# EAGLE schematic b0_comp (EAGLE 6.4), part 1 of 2

## Sheet 1 of 9
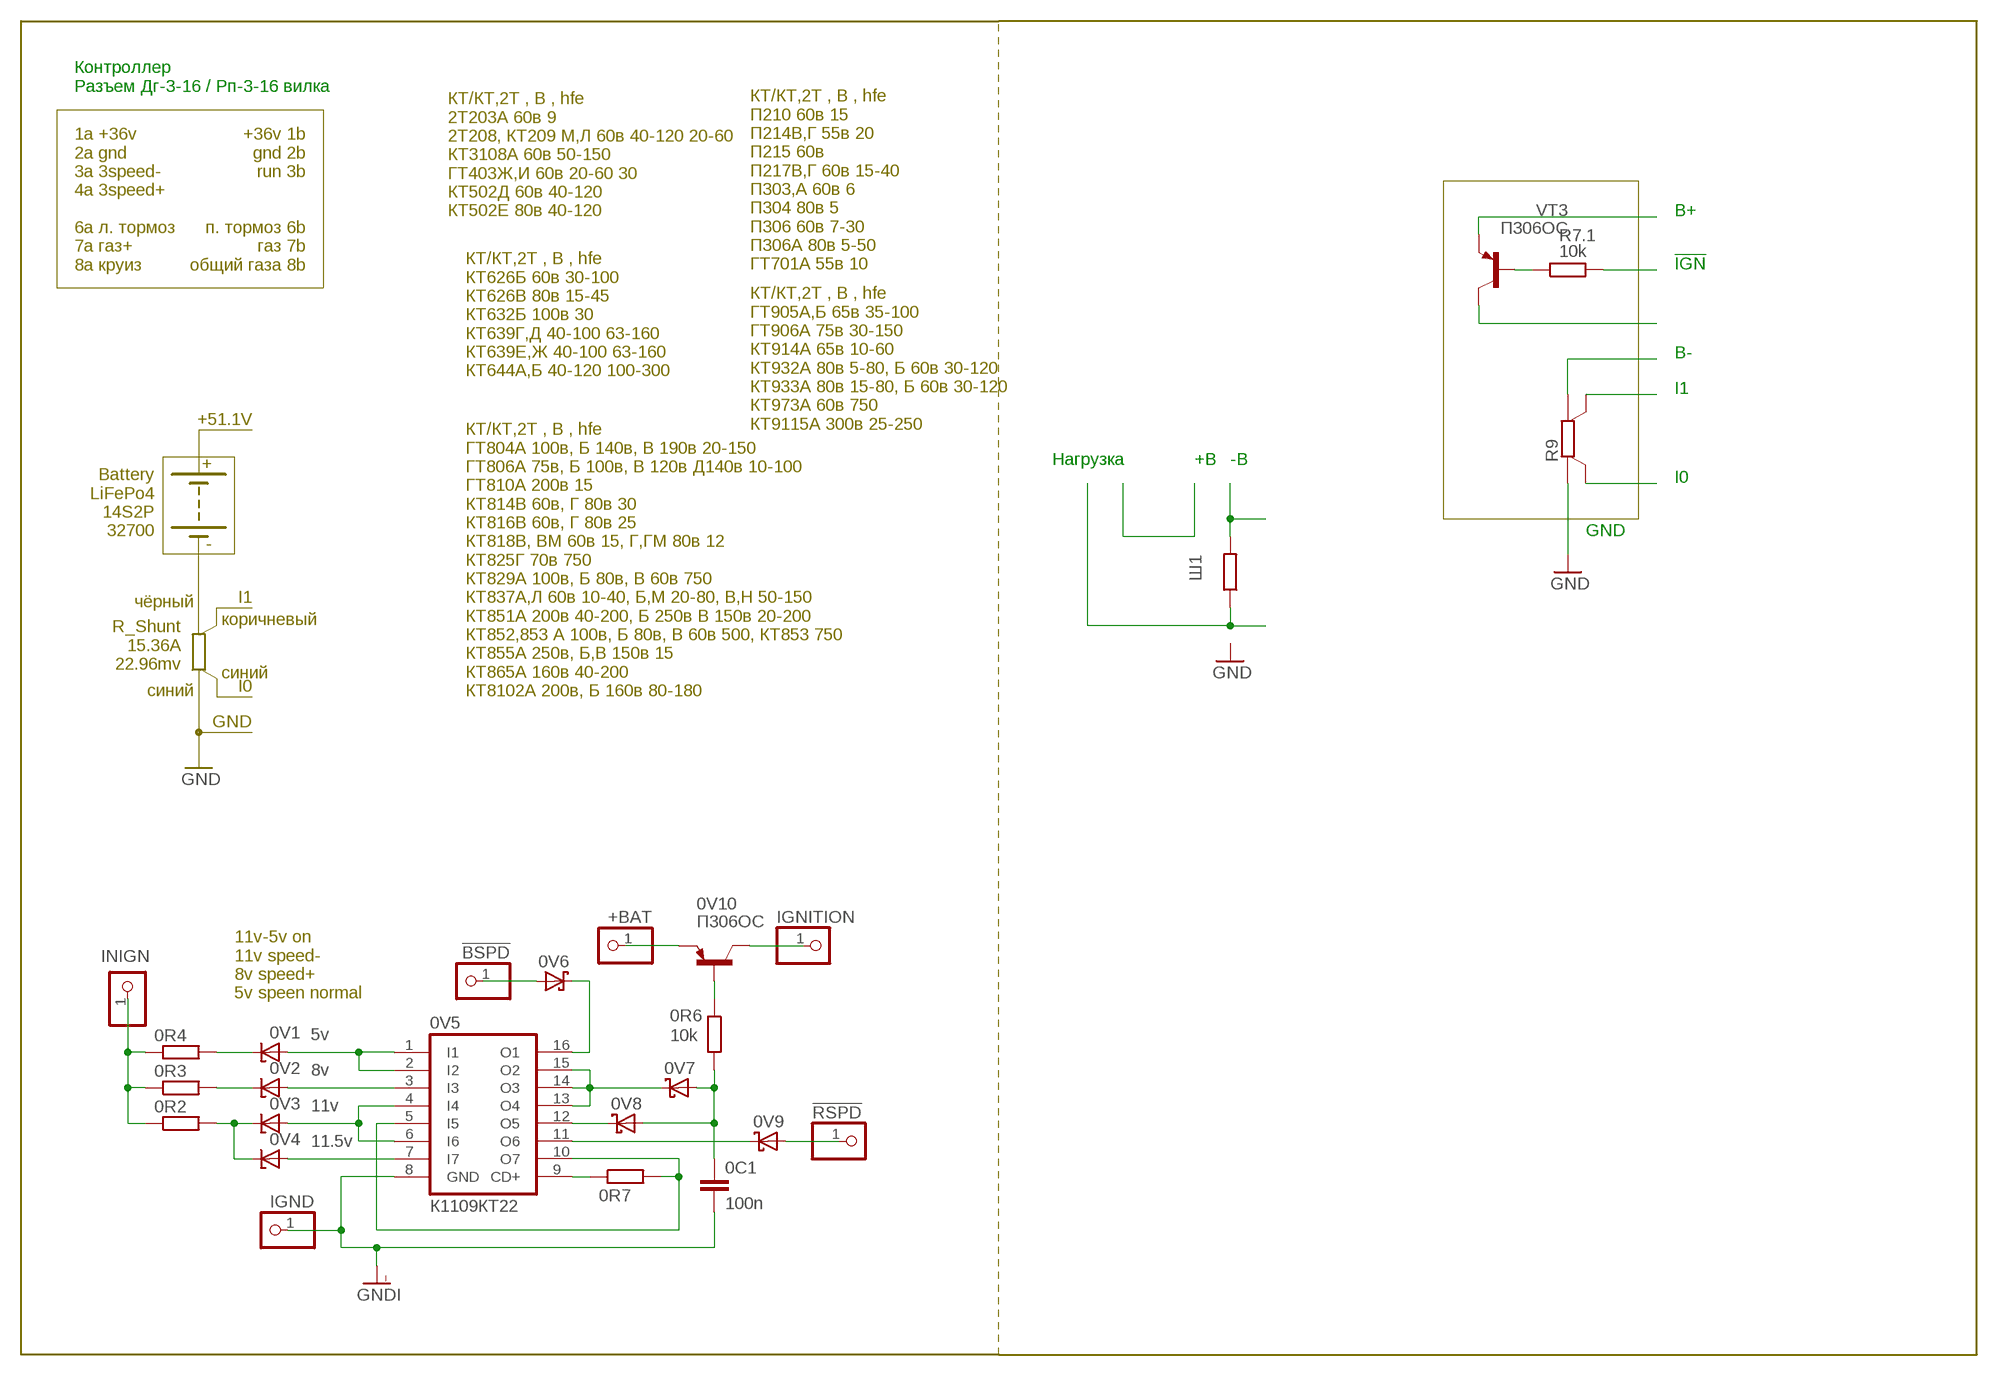
[diagram p0: schematic, sheet 1]

### Parts
0C1  100n  C-EUC0805  [C0805]
0R2  R-EU_R0805  [R0805]
0R3  R-EU_R0805  [R0805]
0R4  R-EU_R0805  [R0805]
0R6  10k  R-EU_R0805  [R0805]
0R7  R-EU_R0805  [R0805]
0V1  5v  ZENER-DIODEDO34-7  [DO34Z7]
0V2  8v  ZENER-DIODEDO34-7  [DO34Z7]
0V3  11v  ZENER-DIODEDO34-7  [DO34Z7]
0V4  11.5v  ZENER-DIODEDO34-7  [DO34Z7]
0V5  К1109КТ22  ULN2003AN  [DIL16]
0V6  SCHOTTKY-DIODESMD  [SMB]
0V7  SCHOTTKY-DIODESMD  [SMB]
0V8  SCHOTTKY-DIODESMD  [SMB]
0V9  SCHOTTKY-DIODESMD  [SMB]
0V10  П306ОС  BJT_PNP_TO-92_CBE  [TO92]
!BSPD  PINHD-1X1  [1X01]
!RSPD  PINHD-1X1  [1X01]
+BAT  PINHD-1X1  [1X01]
IGND  PINHD-1X1  [1X01]
IGNITION  PINHD-1X1  [1X01]
INIGN  PINHD-1X1  [1X01]
R7.1  10k  R-EU_R0805  [R0805]
R9  PMA-A  [PMA-A]
R_SHUNT  S  [S]
VT3  П306ОС  BJT_PNP_TO-92_EBC  [TO92]
Ш1  R-EU_R0805  [R0805]

### Nets
GND: R9.B ; also sheet 2,3,4,5,6,8,9
GNDI: 0C1.2 0V5.8(GND) IGND.1 ; also sheet 3
N$3: 0V5.13(O4) 0V5.14(O3) 0V5.15(O2) 0V7.C
N$64: VT3.3(C)
N$79: 0V3.A 0V5.4(I4) 0V5.6(I6)
N$80: 0C1.1 0R6.2 0V7.A 0V8.A
N$81: 0V2.A 0V5.3(I3)
N$82: 0R3.2 0V2.C
N$83: 0R2.1 0R3.1 0R4.1 INIGN.1
N$84: 0V1.A 0V5.1(I1) 0V5.2(I2)
N$85: 0R4.2 0V1.C
N$86: 0R6.1 0V10.2(B)
N$87: 0V10.1(C) IGNITION.1
N$88: 0V4.A 0V5.7(I7)
N$89: 0R2.2 0V3.C 0V4.C
N$90: 0V6.A !BSPD.1
N$91: 0R7.2 0V5.5(I5) 0V5.10(O7)
N$92: 0V5.11(O6) 0V9.C
N$93: 0V9.A !RSPD.1
N$94: 0V5.16(O1) 0V6.C
N$96: 0V10.3(E) +BAT.1
N$97: 0R7.1 0V5.9(CD+)
N$99: 0V5.12(O5) 0V8.C
N$100: Ш1.2
N$101: Ш1.1
N$104: R9.SB
N$105: R9.A
N$106: R9.SA
N$107: R7.1.1 VT3.2(B)
N$114: R7.1.2
N$115: VT3.1(E)

### Notes on the sheet
- Контроллер
  Разъем Дг-3-16 / Рп-3-16 вилка
- 1a +36v
  2a gnd
  3a 3speed-
  4a 3speed+
  
  6a л. тормоз
  7a газ+
  8a круиз
- +36v 1b
  gnd 2b
  run 3b
  
  
  п. тормоз 6b
  газ 7b
  общий газа 8b
- КТ/КТ,2Т , В , hfe
  2Т203А 60в 9
  2Т208, КТ209 М,Л 60в 40-120 20-60
  КТ3108А 60в 50-150
  ГТ403Ж,И 60в 20-60 30
  КТ502Д 60в 40-120
  КТ502Е 80в 40-120
- B+
- КТ/КТ,2Т , В , hfe
  П210 60в 15
  П214В,Г 55в 20
  П215 60в
  П217В,Г 60в 15-40
  П303,А 60в 6
  П304 80в 5
  П306 60в 7-30
  П306А 80в 5-50
  ГТ701А 55в 10
- !IGN
- B-
- КТ/КТ,2Т , В , hfe
  КТ626Б 60в 30-100
  КТ626В 80в 15-45
  КТ632Б 100в 30
  КТ639Г,Д 40-100 63-160
  КТ639Е,Ж 40-100 63-160
  КТ644А,Б 40-120 100-300
- I1
- КТ/КТ,2Т , В , hfe
  ГТ905А,Б 65в 35-100
  ГТ906А 75в 30-150
  КТ914А 65в 10-60
  КТ932А 80в 5-80, Б 60в 30-120
  КТ933А 80в 15-80, Б 60в 30-120
  КТ973А 60в 750
  КТ9115А 300в 25-250
- Нагрузка | +B | -B
- I0
- GND
- чёрный
- коричневый
- синий
- синий
- КТ/КТ,2Т , В , hfe
  ГТ804А 100в, Б 140в, В 190в 20-150
  ГТ806А 75в, Б 100в, В 120в Д140в 10-100
  ГТ810А 200в 15
  КТ814В 60в, Г 80в 30
  КТ816В 60в, Г 80в 25
  КТ818В, ВМ 60в 15, Г,ГМ 80в 12
  КТ825Г 70в 750
  КТ829А 100в, Б 80в, В 60в 750
  КТ837А,Л 60в 10-40, Б,М 20-80, В,Н 50-150
  КТ851А 200в 40-200, Б 250в В 150в 20-200
  КТ852,853 А 100в, Б 80в, В 60в 500, КТ853 750
  КТ855А 250в, Б,В 150в 15
  КТ865А 160в 40-200
  КТ8102А 200в, Б 160в 80-180
- 11v-5v on
  11v speed-
  8v speed+
  5v speen normal

## Sheet 2 of 9
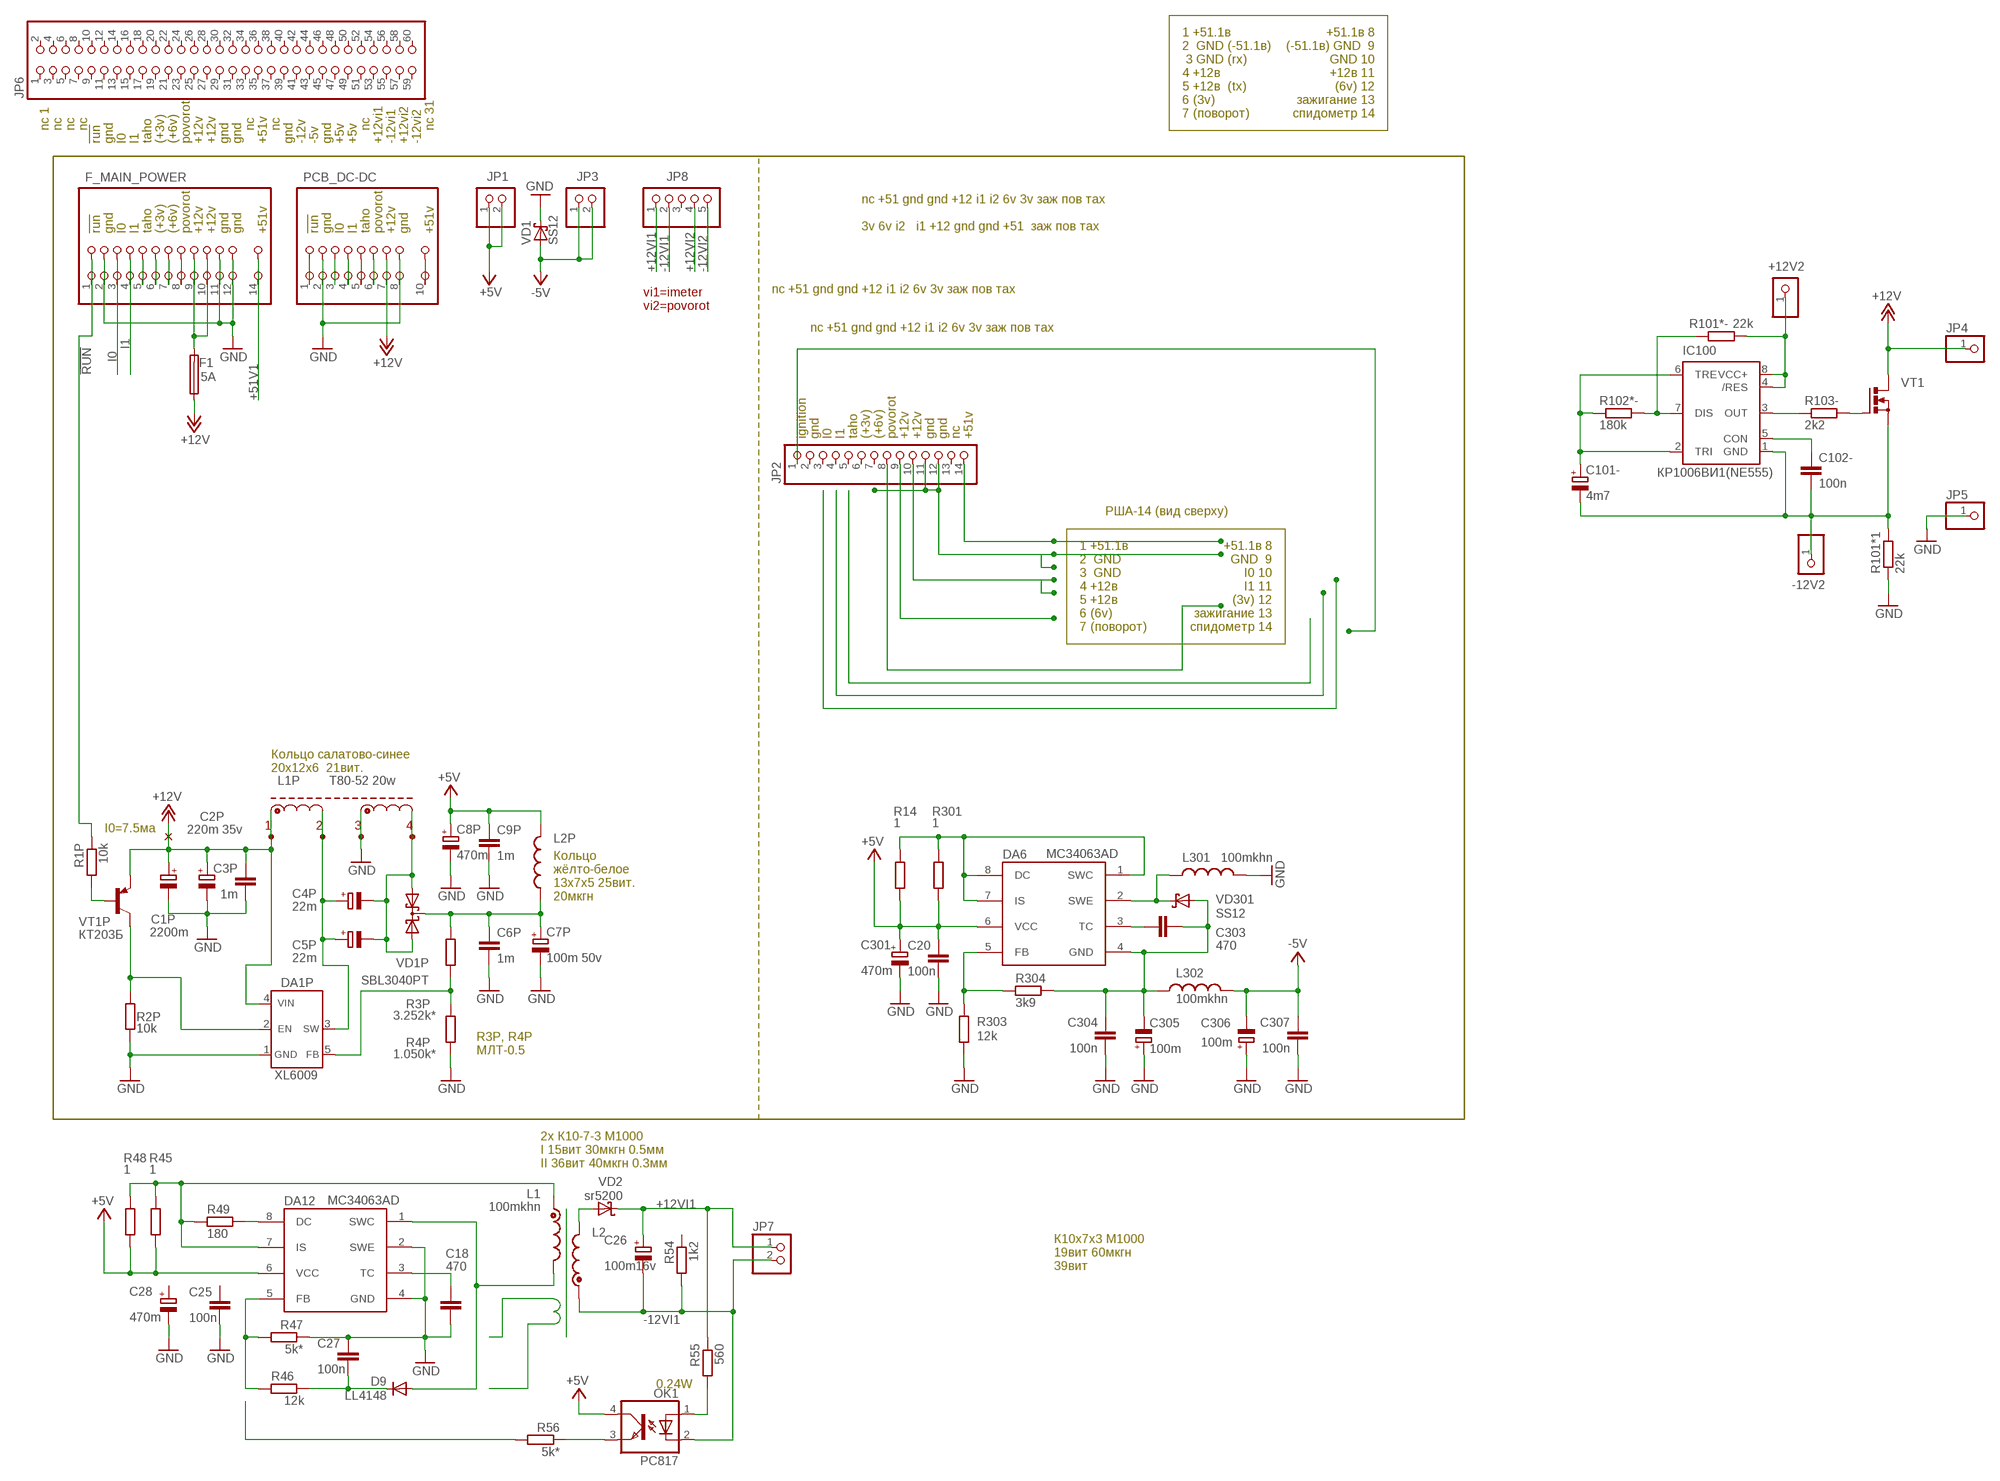
[diagram p1: schematic, sheet 2]

### Parts
1  T_PIN  [PIN-2MM]
2  T_PIN  [PIN-2MM]
3  T_PIN  [PIN-2MM]
4  T_PIN  [PIN-2MM]
+12V2  PINHD-1X1  [1X01]
-12V2  PINHD-1X1  [1X01]
C1P  2200m  CPOL-EUE5-13  [E5-13]
C2P  220m 35v  CPOL-EU153CLV-0807  [153CLV-0807]
C3P  1m  C-EUC0805  [C0805]
C4P  22m  CPOL-EUE2.5-5  [E2,5-5]
C5P  22m  CPOL-EUE2.5-5  [E2,5-5]
C6P  1m  C-EUC0805  [C0805]
C7P  100m 50v  CPOL-EU153CLV-0807  [153CLV-0807]
C8P  470m  CPOL-EUE5-10.5  [E5-10,5]
C9P  1m  C-EUC0805  [C0805]
C18  470  C-EUC0805  [C0805]
C20  100n  C-EUC0805  [C0805]
C25  100n  C-EUC0805  [C0805]
C26  100m16v  CPOL-EUE3.5-8  [E3,5-8]
C27  100n  C-EUC0805  [C0805]
C28  470m  CPOL-EUE3.5-8  [E3,5-8]
C101-  4m7  CPOL-EUE2-5  [E2-5]
C102-  100n  C-EUC0805  [C0805]
C301  470m  CPOL-EUE3.5-8  [E3,5-8]
C303  470  C-EUC0805  [C0805]
C304  100n  C-EUC0805  [C0805]
C305  100m  CPOL-EUE2.5-5  [E2,5-5]
C306  100m  CPOL-EUE2.5-5  [E2,5-5]
C307  100n  C-EUC0805  [C0805]
D9  LL4148  DIODE-SOD80C  [SOD80C]
DA1P  XL6009  XL6009S  [TO263-5]
DA6  MC34063AD  [SOIC8]
DA12  MC34063AD  [SOIC8]
F1  5A  FUSESH22,5  [SH22,5]
F_MAIN_POWER  PINHD-2X14  [2X14]
IC100  КР1006ВИ1(NE555)  NE555  [DIL-08]
JP1  PINHD-1X2/2  [1X02]
JP2  PINHD-1X14  [1X14]
JP3  PINHD-1X2/2  [1X02]
JP4  PINHD-1X1  [1X01]
JP5  PINHD-1X1  [1X01]
JP6  PINHD-2X30  [2X30]
JP7  PINHD-1X2  [2X01]
JP8  PINHD-1X5  [1X05]
L1  100mkhn  L-USTFI0305  [TFI0305]
L1P  T80-52 20w  LP  [R23X14]
L2  L-USTFI0410  [TFI0410]
L2P  L0207/10  [0207/10]
L301  100mkhn  L-USTFI0305  [TFI0305]
L302  100mkhn  L-US0204/7  [0204/7]
OK1  PC817  [DIL04]
PCB_DC-DC  PCB_DC-DC  [PCB_DC-DC]
R1P  10k  R-EU_R0805  [R0805]
R2P  10k  R-EU_R0805  [R0805]
R3P  3.252k*  R-EU_R0805  [R0805]
R4P  1.050k*  R-EU_R0805  [R0805]
R14  1  R-EU_R1206  [R1206]
R45  1  R-EU_R1206  [R1206]
R46  12k  R-EU_R0805  [R0805]
R47  5k*  R-EU_R0805  [R0805]
R48  1  R-EU_R1206  [R1206]
R49  180  R-EU_R0805  [R0805]
R54  1k2  R-EU_R0805  [R0805]
R55  560  R-EU_R0805  [R0805]
R56  5k*  R-EU_R0805  [R0805]
R101*1  22k  R-EU_R0805  [R0805]
R101*-  22k  R-EU_R0805  [R0805]
R102*-  180k  R-EU_R0805  [R0805]
R103-  2k2  R-EU_R0805  [R0805]
R301  1  R-EU_R1206  [R1206]
R303  12k  R-EU_R0805  [R0805]
R304  3k9  R-EU_R0805  [R0805]
VD1  SS12  SCHOTTKY-DIODESMD  [SMB]
VD1P  SBL3040PT  SCHOTTKY_DUALTO247H  [TO247H]
VD2  sr5200  SCHOTTKY-DIODESMD  [SMB]
VD301  SS12  SCHOTTKY-DIODESMD  [SMB]
VT1  MOSFET-N_DPACK  [DPACK]
VT1P  КТ203Б  BJT_PNP_TO18_EBC  [TO18]

### Nets
!RUN: F_MAIN_POWER.1 F_MAIN_POWER.1A R1P.1
+5V: C8P.+ C9P.1 C20.1 C301.+ DA6.6(VCC) DA12.6(VCC) JP1.1 JP1.2 L2P.1 OK1.4(COL) R14.1 R45.1 R48.1 R301.1 ; also sheet 3,4,6,9
+12V: 1.1 C1P.+ C2P.+ C3P.1 DA1P.4(VIN) F1.1 JP4.1 PCB_DC-DC.7 PCB_DC-DC.7@ VT1.D VT1P.1(E) ; also sheet 3,4,6
+12VI1: C26.+ JP7.1 JP8.1 R55.1 VD2.C
+12VI2: JP8.4
+51V1: F_MAIN_POWER.14 F_MAIN_POWER.14A ; also sheet 3
-5V: C306.- C307.1 JP3.1 JP3.2 L302.2 VD1.A ; also sheet 3
-12VI1: C26.- JP7.2 JP8.2 L2.2 OK1.2(C) R54.2
-12VI2: JP8.5
GND: 3.1 C1P.- C2P.- C3P.2 C6P.2 C7P.- C8P.- C9P.2 C18.2 C20.2 C25.2 C27.1 C28.- C301.- C304.2 C305.+ C306.+ C307.2 DA1P.1(GND) DA12.2(SWE) DA12.4(GND) F_MAIN_POWER.2 F_MAIN_POWER.2A F_MAIN_POWER.11 F_MAIN_POWER.11A F_MAIN_POWER.12 F_MAIN_POWER.12A JP5.1 L301.2 PCB_DC-DC.2 PCB_DC-DC.2@ PCB_DC-DC.8 PCB_DC-DC.8@ R2P.1 R4P.1 R47.1 R101*1.1 R303.1 VD1.C ; also sheet 1,3,4,5,6,8,9
I0: F_MAIN_POWER.3 F_MAIN_POWER.3A
I1: F_MAIN_POWER.4 F_MAIN_POWER.4A
N$4: IC100.7(DIS) R101*-.1 R102*-.2
N$5: C101-.+ IC100.2(TRI) IC100.6(TRE) R102*-.1
N$6: C102-.1 IC100.5(CON)
N$7: IC100.3(OUT) R103-.1
N$8: R103-.2 VT1.G
N$9: +12V2.1 IC100.4(/RES) IC100.8(VCC+) R101*-.2
N$10: -12V2.1 C101-.- C102-.2 IC100.1(GND) R101*1.2 VT1.S
N$21: 4.1 C4P.- C5P.- VD1P.1(A1) VD1P.3(A2)
N$22: C6P.1 C7P.+ L2P.2 R3P.2 VD1P.2(C)
N$108: DA1P.2(EN) R2P.2 VT1P.3(C)
N$140: JP2.14
N$147: JP2.11 JP2.12
N$156: JP2.10
N$157: JP2.9
N$158: JP2.8
N$161: JP2.1
N$164: R1P.2 VT1P.2(B)
N$170: F_MAIN_POWER.5 F_MAIN_POWER.5A
N$171: F_MAIN_POWER.6 F_MAIN_POWER.6A
N$173: F_MAIN_POWER.7 F_MAIN_POWER.7A
N$174: F_MAIN_POWER.8 F_MAIN_POWER.8A
N$175: PCB_DC-DC.3 PCB_DC-DC.3@
N$176: PCB_DC-DC.5 PCB_DC-DC.5@
N$177: F1.2 F_MAIN_POWER.9 F_MAIN_POWER.9A F_MAIN_POWER.10 F_MAIN_POWER.10A
N$178: PCB_DC-DC.4 PCB_DC-DC.4@
N$179: PCB_DC-DC.6 PCB_DC-DC.6@
N$180: DA12.5(FB) R46.1 R47.2
N$183: PCB_DC-DC.10 PCB_DC-DC.10@
N$184: PCB_DC-DC.1 PCB_DC-DC.1@
N$185: 2.1 C4P.+ C5P.+ DA1P.3(SW)
N$189: DA1P.5(FB) R3P.1 R4P.2
N$287: DA6.5(FB) R303.2 R304.1
N$290: C303.2 C304.1 C305.- DA6.4(GND) L302.1 R304.2 VD301.A
N$291: D9.A DA12.1(SWC) L1.2
N$292: DA6.1(SWC) DA6.7(IS) DA6.8(DC) R14.2 R301.2
N$294: DA6.2(SWE) L301.1 VD301.C
N$295: C303.1 DA6.3(TC)
N$301: DA12.8(DC) R49.2
N$303: C18.1 DA12.3(TC)
N$305: L2.1 VD2.A
N$316: DA12.7(IS) L1.1 R45.2 R48.2 R49.1
N$337: C27.2 D9.C R46.2
N$418: OK1.1(A) R55.2
N$428: OK1.3(EMIT) R56.1
N$429: R56.2
Unconnected: C25.1 C28.+ JP2.2 JP2.3 JP2.4 JP2.5 JP2.6 JP2.7 JP2.13 JP6.1 JP6.2 JP6.3 JP6.4 JP6.5 JP6.6 JP6.7 JP6.8 JP6.9 JP6.10 JP6.11 JP6.12 JP6.13 JP6.14 JP6.15 JP6.16 JP6.17 JP6.18 JP6.19 JP6.20 JP6.21 JP6.22 JP6.23 JP6.24 JP6.25 JP6.26 JP6.27 JP6.28 JP6.29 JP6.30 JP6.31 JP6.32 JP6.33 JP6.34 JP6.35 JP6.36 JP6.37 JP6.38 JP6.39 JP6.40 JP6.41 JP6.42 JP6.43 JP6.44 JP6.45 JP6.46 JP6.47 JP6.48 JP6.49 JP6.50 JP6.51 JP6.52 JP6.53 JP6.54 JP6.55 JP6.56 JP6.57 JP6.58 JP6.59 JP6.60 JP8.3 R54.1

### Notes on the sheet
- 1 +51.1в
  2  GND (-51.1в)
   3 GND (rx)
  4 +12в
  5 +12в  (tx)
  6 (3v)
  7 (поворот)
- +51.1в 8
  (-51.1в) GND  9
  GND 10
  +12в 11
  (6v) 12
  зажигание 13
  спидометр 14
- nc 1 | nc | nc | nc | nc | nc | nc | nc 31
- !run | gnd | I0 | I1 | taho | (+3v) | (+6v) | povorot | +12v | +12v | gnd | gnd | +51v | gnd | -12v | -5v | gnd | +5v | +5v | +12vi1 | -12vi1 | +12vi2 | -12vi2
- nc +51 gnd gnd +12 i1 i2 6v 3v заж пов тах
  
  3v 6v i2   i1 +12 gnd gnd +51  заж пов тах
- !run | gnd | I0 | I1 | taho | (+3v) | (+6v) | povorot | +12v | +12v | gnd | gnd | +51v | !run | gnd | I0 | I1 | taho | povorot | +12v | gnd | +51v
- nc +51 gnd gnd +12 i1 i2 6v 3v заж пов тах
- vi1=imeter
  vi2=povorot
- nc +51 gnd gnd +12 i1 i2 6v 3v заж пов тах
- ignition | gnd | I0 | I1 | taho | (+3v) | (+6v) | povorot | +12v | +12v | gnd | gnd | nc | +51v
- РША-14 (вид сверху)
- 1 +51.1в
  2  GND
  3  GND
  4 +12в
  5 +12в 
  6 (6v)
  7 (поворот)
- +51.1в 8
  GND  9
  I0 10
  I1 11
  (3v) 12
  зажигание 13
  спидометр 14
- Кольцо салатово-синее
  20x12x6  21вит.
- Кольцо
  жёлто-белое
  13x7x5 25вит.
  20мкгн
- R3P, R4P
  МЛТ-0.5
- 2x К10-7-3 М1000
  I 15вит 30мкгн 0.5мм 
  II 36вит 40мкгн 0.3мм
- К10х7х3 М1000
  19вит 60мкгн
  39вит
- 0.24W

## Sheet 3 of 9
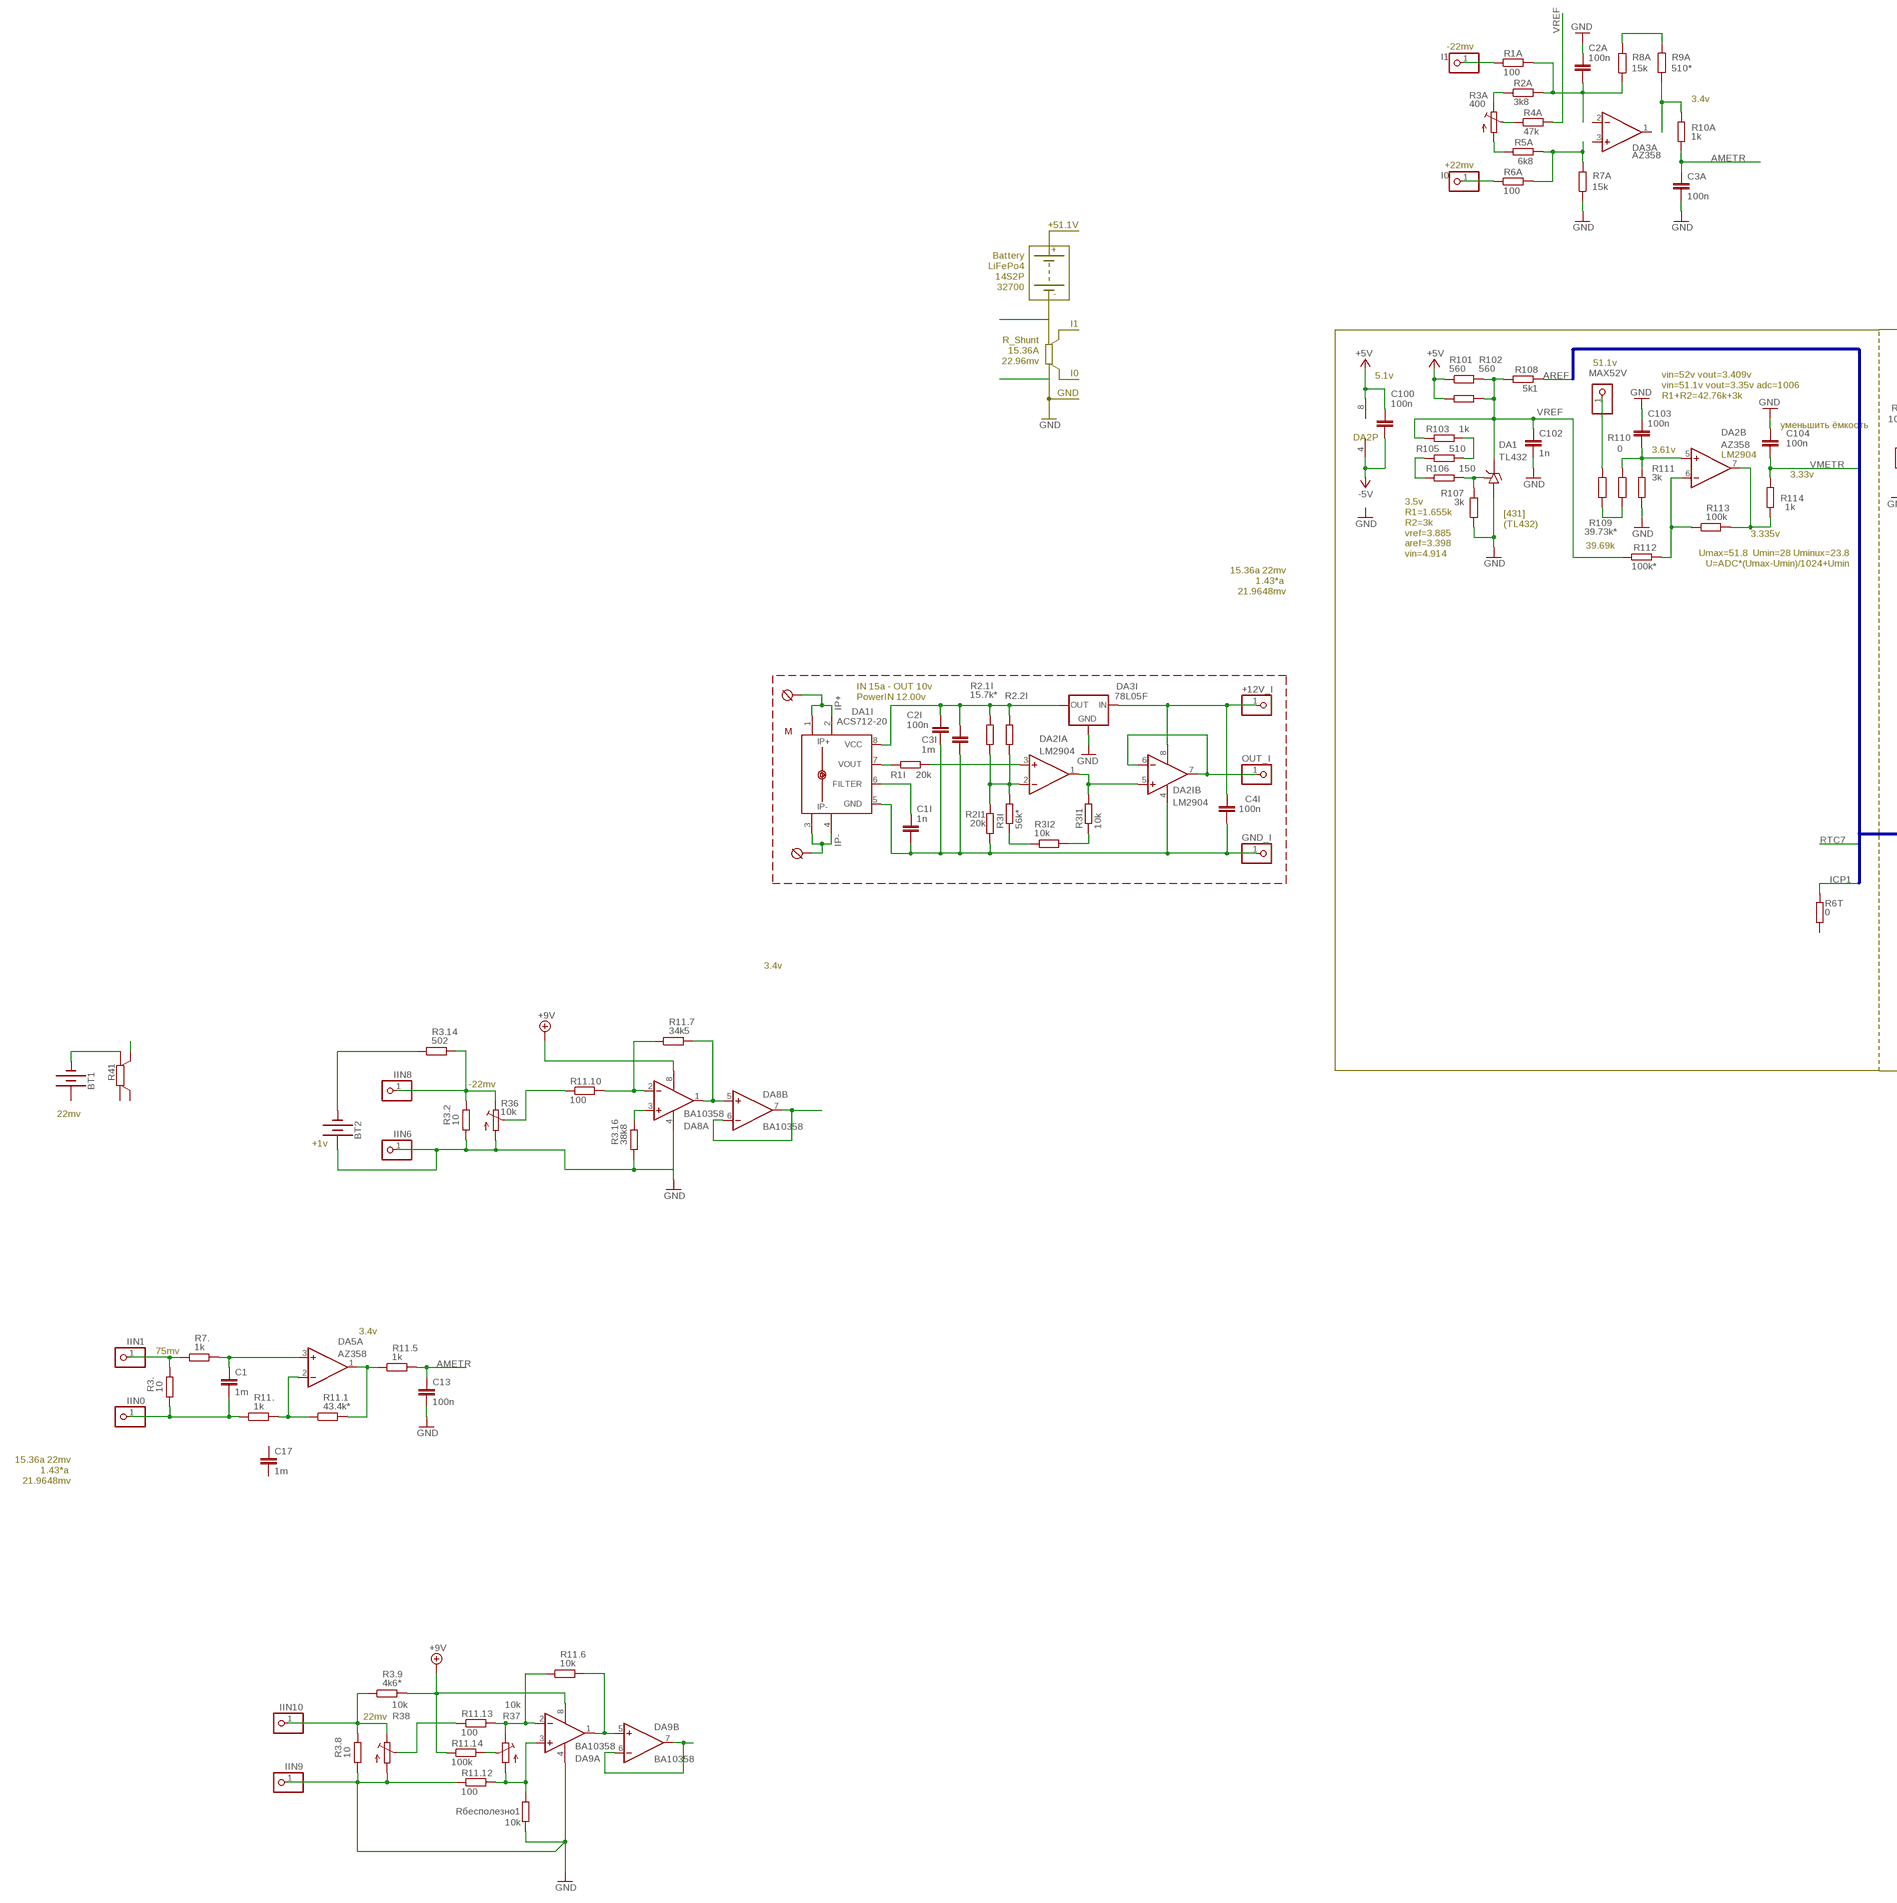
[diagram p2: schematic, sheet 3, part 1 of 2]
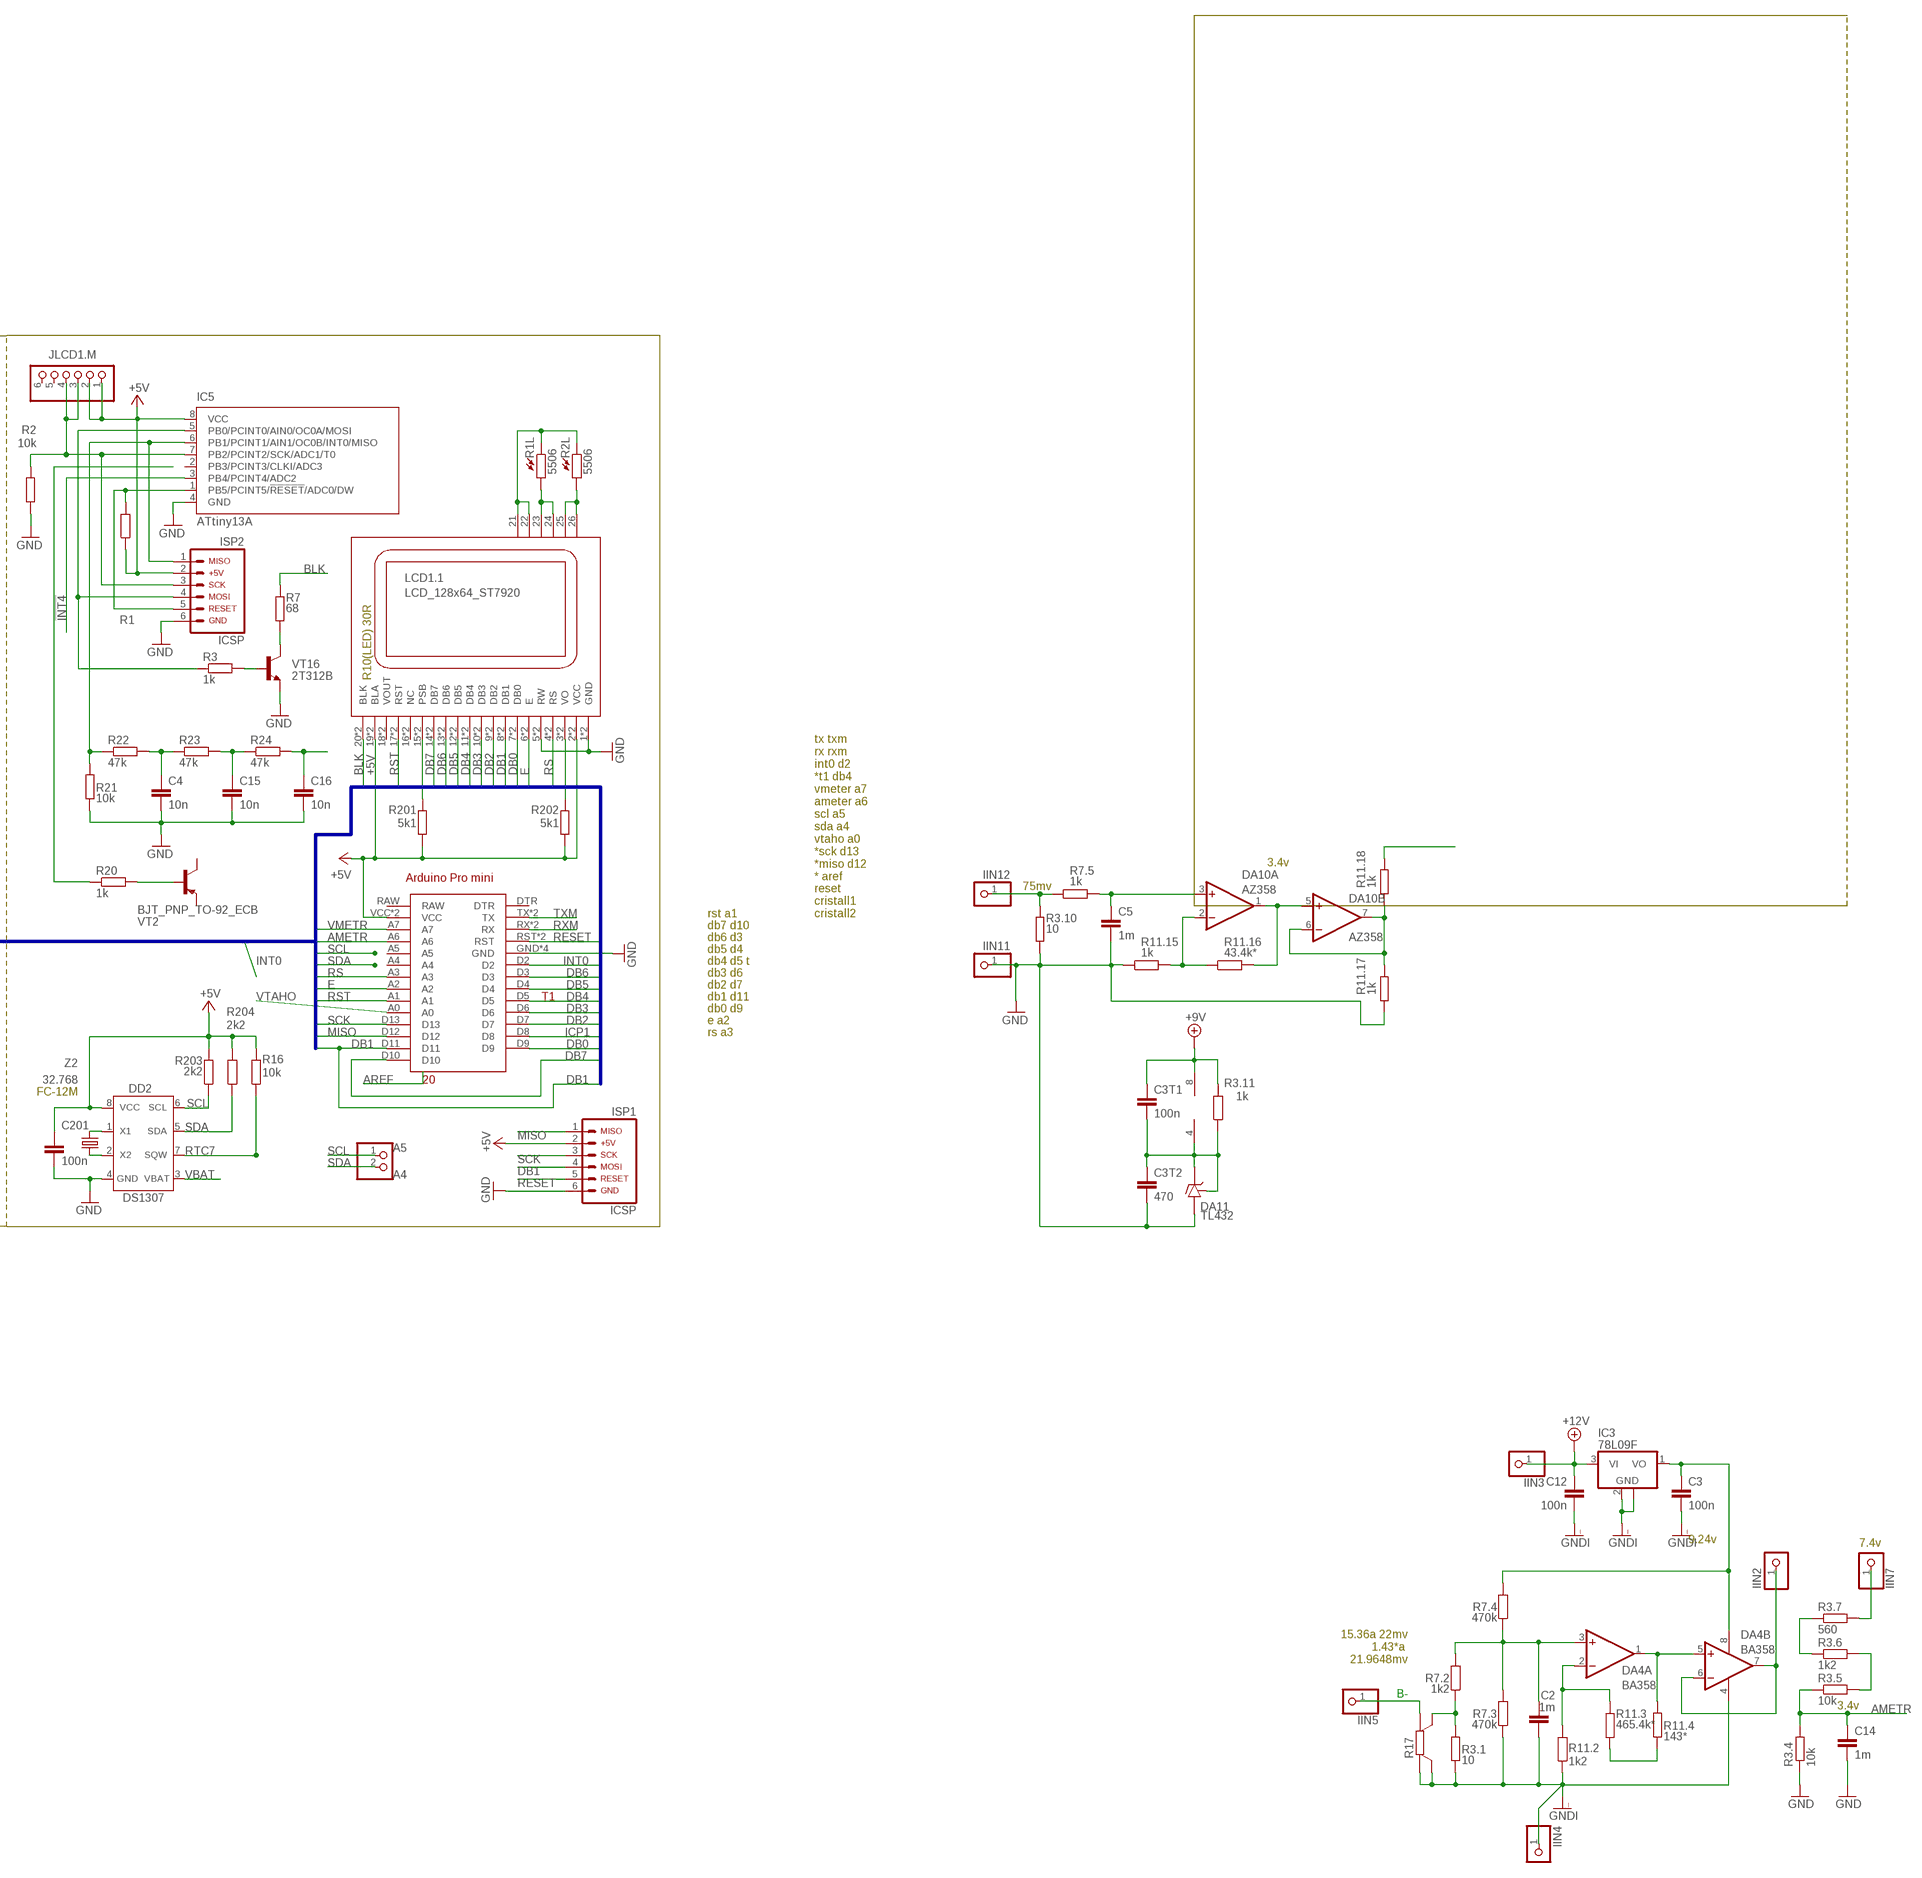
[diagram p3: schematic, sheet 3, part 2 of 2]

### Parts
+12V_I  PINHD-1X1  [1X01]
A5  A4  PINHD-1X2  [2X01]
ARDUINO1  ARDUINO_PRO_MINI  [ARDUINO_PRO_MINI]
BT1  BATTERY-AA  [BATTERY-AA]
BT2  BATTERY-AA  [BATTERY-AA]
C1  1m  C-EUC0805  [C0805]
C1I  1n  C-EUC0805  [C0805]
C2  1m  C-EUC0805  [C0805]
C2A  100n  C-EUC0805  [C0805]
C2I  100n  C-EUC0805  [C0805]
C3  100n  C-EU075-032X103  [C075-032X103]
C3A  100n  C-EUC0805  [C0805]
C3I  1m  C-EUC0805  [C0805]
C3T1  100n  C-EUC0805  [C0805]
C3T2  470  C-EUC0805  [C0805]
C4  10n  C-EUC0805  [C0805]
C4I  100n  C-EUC0805  [C0805]
C5  1m  C-EUC0805  [C0805]
C12  100n  C-EUC0805  [C0805]
C13  100n  C-EUC0805  [C0805]
C14  1m  C-EUC0805  [C0805]
C15  10n  C-EUC0805  [C0805]
C16  10n  C-EUC0805  [C0805]
C17  1m  C-EUC0805  [C0805]
C100  100n  C-EUC0805  [C0805]
C102  1n  C-EUC0805  [C0805]
C103  100n  C-EUC0805  [C0805]
C104  100n  C-EUC0805  [C0805]
C201  100n  C-EUC0805  [C0805]
DA1  TL432  [SOT-23]
DA1I  ACS712-20  ACS712-LC  [SOIC8]
DA2  AZ358  LM358D  [SO08]
DA2I  LM2904  LM358D  [SO08]
DA3  AZ358  LM358D  [SO08]
DA3I  78L05F  [SOT89]
DA4  BA358  LM358D  [SO08]
DA5  AZ358  LM358D  [SO08]
DA8  BA10358  LM358D  [SO08]
DA9  BA10358  LM358D  [SO08]
DA10  AZ358  LM358D  [SO08]
DA11  TL432  [SOT-23]
DD2  DS1307  [DIL08]
GND_I  PINHD-1X1  [1X01]
I0  PINHD-1X1  [1X01]
I1  PINHD-1X1  [1X01]
IC3  78L09F  [SOT89]
IC5  ATtiny13A  TINY13-20PU  [DIL08]
IIN0  PINHD-1X1  [1X01]
IIN1  PINHD-1X1  [1X01]
IIN2  PINHD-1X1  [1X01]
IIN3  PINHD-1X1  [1X01]
IIN4  PINHD-1X1  [1X01]
IIN5  PINHD-1X1  [1X01]
IIN6  PINHD-1X1  [1X01]
IIN7  PINHD-1X1  [1X01]
IIN8  PINHD-1X1  [1X01]
IIN9  PINHD-1X1  [1X01]
IIN10  PINHD-1X1  [1X01]
IIN11  PINHD-1X1  [1X01]
IIN12  PINHD-1X1  [1X01]
ISP1  ARDUINO_CONN-ICSP  [CONN-2X03]
ISP2  ARDUINO_CONN-ICSP  [CONN-2X03]
JLCD1.M  PINHD-1X6  [1X06]
LCD1  LCD_128x64_ST7920  12864B  [12864B]
MAX52V  PINHD-1X1  [1X01]
OUT_I  PINHD-1X1  [1X01]
R1  R-EU_R0805  [R0805]
R1A  100  R-EU_R0805  [R0805]
R1I  20k  R-EU_R0805  [R0805]
R1L  5506  R_O  [R_O]
R2  10k  R-EU_R0805  [R0805]
R2.1I  15.7k*  R-EU_R0805  [R0805]
R2.2I  R-EU_R0805  [R0805]
R2A  3k8  R-EU_R0805  [R0805]
R2I1  20k  R-EU_R0805  [R0805]
R2L  5506  R_O  [R_O]
R3  1k  R-EU_R0805  [R0805]
R3.  10  R-EU_R0805  [R0805]
R3.1  10  R-EU_R0805  [R0805]
R3.2  10  R-EU_R0805  [R0805]
R3.4  10k  R-EU_R0805  [R0805]
R3.5  10k  R-EU_R0805  [R0805]
R3.6  1k2  R-EU_R0805  [R0805]
R3.7  560  R-EU_R0805  [R0805]
R3.8  10  R-EU_R0805  [R0805]
R3.9  4k6*  R-EU_R0805  [R0805]
R3.10  10  R-EU_R0805  [R0805]
R3.11  1k  R-EU_R0805  [R0805]
R3.14  502  R-EU_R0805  [R0805]
R3.16  38k8  R-EU_R0805  [R0805]
R3A  400  R-TRIMM3296W  [RTRIM3296W]
R3I  56k*  R-EU_R0805  [R0805]
R3I1  10k  R-EU_R0805  [R0805]
R3I2  10k  R-EU_R0805  [R0805]
R4A  47k  R-EU_R0805  [R0805]
R5A  6k8  R-EU_R0805  [R0805]
R6A  100  R-EU_R0805  [R0805]
R6T  0  R-EU_R0805  [R0805]
R7  68  R-EU_R0805  [R0805]
R7.  1k  R-EU_R0805  [R0805]
R7.2  1k2  R-EU_R0805  [R0805]
R7.3  470k  R-EU_R0805  [R0805]
R7.4  470k  R-EU_R0805  [R0805]
R7.5  1k  R-EU_R0805  [R0805]
R7A  15k  R-EU_R0805  [R0805]
R8A  15k  R-EU_R0805  [R0805]
R9A  510*  R-EU_R0805  [R0805]
R10A  1k  R-EU_R0805  [R0805]
R11.  1k  R-EU_R0805  [R0805]
R11.1  43.4k*  R-EU_R0805  [R0805]
R11.2  1k2  R-EU_R0805  [R0805]
R11.3  465.4k*  R-EU_R0805  [R0805]
R11.4  143*  R-EU_R0805  [R0805]
R11.5  1k  R-EU_R0805  [R0805]
R11.6  10k  R-EU_R0805  [R0805]
R11.7  34k5  R-EU_R0805  [R0805]
R11.10  100  R-EU_R0805  [R0805]
R11.12  100  R-EU_R0805  [R0805]
R11.13  100  R-EU_R0805  [R0805]
R11.14  100k  R-EU_R0805  [R0805]
R11.15  1k  R-EU_R0805  [R0805]
R11.16  43.4k*  R-EU_R0805  [R0805]
R11.17  1k  R-EU_R0805  [R0805]
R11.18  1k  R-EU_R0805  [R0805]
R16  10k  R-EU_R0805  [R0805]
R17  PMA-A  [PMA-A]
R20  1k  R-EU_R0805  [R0805]
R21  10k  R-EU_R0805  [R0805]
R22  47k  R-EU_R0805  [R0805]
R23  47k  R-EU_R0805  [R0805]
R24  47k  R-EU_R0805  [R0805]
R36  10k  R-TRIMM3202  [RTRIM3202]
R37  10k  R-TRIMM3202  [RTRIM3202]
R38  10k  R-TRIMM3202  [RTRIM3202]
R41  PMA-A  [PMA-A]
R101  560  R-EU_R0805  [R0805]
R102  560  R-EU_R0805  [R0805]
R103  1k  R-EU_R0805  [R0805]
R105  510  R-EU_R0805  [R0805]
R106  150  R-EU_R0805  [R0805]
R107  3k  R-EU_R0805  [R0805]
R108  5k1  R-EU_R0805  [R0805]
R109  39.73k*  R-EU_0207/10  [0207/10]
R110  0  R-EU_R0805  [R0805]
R111  3k  R-EU_R0805  [R0805]
R112  100k*  R-EU_R0805  [R0805]
R113  100k  R-EU_R0805  [R0805]
R114  1k  R-EU_R0805  [R0805]
R201  5k1  R-EU_R0805  [R0805]
R202  5k1  R-EU_R0805  [R0805]
R203  2k2  R-EU_R0805  [R0805]
R204  2k2  R-EU_R0805  [R0805]
Rбесполезно1  10k  R-EU_R0805  [R0805]
U$19  S  [S]
U$23  PIN_D  [PIN_D3MM]
U$24  PIN_D  [PIN_D3MM]
VT2  BJT_PNP_TO-92_ECB  [TO92]
VT16  2Т312В  BJT_NPN_TO-92_CBE  [TO92]
Z2  32.768  FC-12M  [FC-12M]

### Nets
1: LCD1.21 LCD1.22 R1L.P$1 R2L.P$1
!INT4: IC5.3(PB4/PCINT4/ADC2)
+5V: ARDUINO1.VCC ARDUINO1.VCC@1(VCC) C100.1 C201.1 DA2.8(P:V+) DD2.8(VCC) IC5.8(VCC) ISP1.2 ISP2.2 JLCD1.M.1 JLCD1.M.2 LCD1.2(.1:VCC) LCD1.2@(.1:VCC) LCD1.19(.1:BLA) LCD1.19@(.1:BLA) R1.1 R16.2 R101.1 R102.2 R201.1 R202.1 R203.2 R204.2 ; also sheet 2,4,6,9
+5VI: C2I.1 C3I.1 DA1I.8(VCC) DA3I.1(OUT) R2.1I.2 R2.2I.2
+9V: C3T1.1 DA8.8(P:V+) DA9.8(P:V+) DA10.8(P:V+) R3.9.2 R3.11.2 R11.14.1
+12V: C12.1 IC3.3(VI) IIN3.1 ; also sheet 2,4,6
+12VI: +12V_I.1 C4I.1 DA2I.8(P:V+) DA3I.3(IN)
+51V1: MAX52V.1 R109.1 ; also sheet 2
-5V: C100.2 DA2.4(P:V-) ; also sheet 2
AMETR: ARDUINO1.A6 C3A.1 C13.1 C14.1 R3.4.2 R3.5.1 R10A.1 R11.5.2
AREF: R108.1
AREF2V5: DA1.1(R) R106.1 R107.2
BLK: LCD1.20(.1:BLK) LCD1.20@(.1:BLK) R7.2
DB0: ARDUINO1.D9 LCD1.7(.1:DB0) LCD1.7@(.1:DB0)
DB1: ARDUINO1.D11 ISP1.4 LCD1.8(.1:DB1) LCD1.8@(.1:DB1) ; also sheet 6
DB2: ARDUINO1.D7 LCD1.9(.1:DB2) LCD1.9@(.1:DB2)
DB3: ARDUINO1.D6 LCD1.10(.1:DB3) LCD1.10@(.1:DB3)
DB4: ARDUINO1.D5 LCD1.11(.1:DB4) LCD1.11@(.1:DB4)
DB5: ARDUINO1.D4 LCD1.12(.1:DB5) LCD1.12@(.1:DB5)
DB6: ARDUINO1.D3 LCD1.13(.1:DB6) LCD1.13@(.1:DB6)
DB7: ARDUINO1.D10 LCD1.14(.1:DB7) LCD1.14@(.1:DB7)
E: ARDUINO1.A2 LCD1.6(.1:E) LCD1.6@(.1:E)
GND: ARDUINO1.GND ARDUINO1.GND@1(GND) ARDUINO1.GND@2(GND) ARDUINO1.GND@3(GND) BT2.PWR@1(+) C2A.1 C3A.2 C3T2.2 C4.2 C5.2 C13.2 C14.2 C15.2 C16.2 C102.2 C103.1 C104.1 C201.2 DA1.3(A) DA3I.2(GND) DA3I.2@1(GND) DA8.4(P:V-) DA9.4(P:V-) DA11.3(A) DD2.4(GND) IC5.4(GND) IIN6.1 IIN9.1 IIN11.1 ISP1.6 ISP2.6 LCD1.1(.1:GND) LCD1.1@(.1:GND) LCD1.5(.1:RW) LCD1.5@(.1:RW) R2.1 R3.2.1 R3.4.1 R3.8.1 R3.10.1 R3.16.1 R7A.1 R11.12.1 R11.15.1 R11.17.1 R21.1 R36.1(A) R38.1(A) R107.1 R111.1 Rбесполезно1.1 VT16.3(E) ; also sheet 1,2,4,5,6,8,9
GNDI: C1I.2 C2.2 C2I.2 C3.2 C3I.2 C4I.2 C12.2 DA1I.5(GND) DA2I.4(P:V-) DA4.4(P:V-) GND_I.1 IC3.2(GND) IC3.2@1(GND) IIN4.1 R2I1.1 R3.1.1 R7.3.1 R11.2.1 R17.B R17.SB ; also sheet 1
ICP1: ARDUINO1.D8 R6T.2
INT0: ARDUINO1.D2
IP+: DA1I.1(IP+) DA1I.2(IP+1) U$23.P$1
IP-: DA1I.3(IP-) DA1I.4(IP-1) U$24.P$1
MISO: ARDUINO1.D12 ISP1.1 ; also sheet 6
MISO13: IC5.6(PB1/PCINT1/AIN1/OC0B/INT0/MISO) ISP2.1 R21.2 R22.1
MOSI13: IC5.5(PB0/PCINT0/AIN0/OC0A/MOSI) ISP2.4 R3.1
N$1: LCD1.3(.1:VO) LCD1.3@(.1:VO) R202.2
N$2: LCD1.15(.1:PSB) LCD1.15@(.1:PSB) R201.2
N$11: C103.2 DA2.5(B:+IN) R110.1 R111.2
N$17: DA5.2(A:-IN) R11.1.1 R11..2
N$18: R3.2 VT16.2(B)
N$19: R109.2 R110.2
N$20: R20.2 VT2.3(B)
N$23: R20.1
N$26: C4.1 R22.2 R23.1
N$31: C1.1 DA5.3(A:+IN) R7..2
N$32: DA2.7(B:OUT) R113.2 R114.1
N$34: IIN1.1 R3..2 R7..1
N$35: DA2.6(B:-IN) R112.1 R113.1
N$36: R103.1 R105.1
N$37: R105.2 R106.2
N$51: DA8.3(A:+IN) R3.16.2
N$52: R8A.2 R9A.1
N$61: IIN8.1 R3.2.2 R3.14.2 R36.3(E)
N$62: R11.10.1 R36.2(S)
N$63: DA8.1(A:OUT) DA8.5(B:+IN) R11.7.2
N$67: C15.1 R23.2 R24.1
N$68: DD2.1(X1) Z2.P$2
N$69: C16.1 R24.2
N$70: DD2.2(X2) Z2.P$1
N$71: DA8.2(A:-IN) R11.7.1 R11.10.2
N$72: DA8.6(B:-IN) DA8.7(B:OUT)
N$98: R7.1 VT16.1(C)
N$109: LCD1.25 LCD1.26 R2L.P$2
N$112: LCD1.23 LCD1.24 R1L.P$2
N$129: DA9.3(A:+IN) R11.12.2 R37.1(A) Rбесполезно1.2
N$132: IIN10.1 R3.8.2 R3.9.1 R38.3(E)
N$135: DA9.1(A:OUT) DA9.5(B:+IN) R11.6.2
N$162: DA9.2(A:-IN) R11.6.1 R11.13.2 R37.3(E)
N$163: R11.14.2 R37.2(S)
N$165: DA9.6(B:-IN) DA9.7(B:OUT)
N$166: R11.13.1 R38.2(S)
N$168: DA10.2(A:-IN) R11.15.2 R11.16.1
N$181: R3I2.1 R3I.1
N$194: DA4.2(A:-IN) R11.2.2 R11.3.1
N$200: C2.1 DA4.3(A:+IN) R7.2.2 R7.3.2 R7.4.1
N$201: R3.1.2 R7.2.1 R17.SA
N$202: DA4.1(A:OUT) DA4.5(B:+IN) R11.4.2
N$203: DA4.6(B:-IN) DA4.7(B:OUT) IIN2.1
N$204: IIN5.1 R17.A
N$205: R11.3.2 R11.4.1
N$206: C3.1 DA4.8(P:V+) IC3.1(VO) R7.4.2
N$207: R3.5.2 R3.6.2
N$208: R3.6.1 R3.7.1
N$209: C1.2 IIN0.1 R3..1 R11..1
N$210: DA5.1(A:OUT) R11.1.2 R11.5.1
N$213: R3A.1(A) R5A.2
N$216: IIN7.1 R3.7.2
N$269: C5.1 DA10.3(A:+IN) R7.5.2
N$270: IIN12.1 R3.10.2 R7.5.1
N$271: R11.18.2
N$272: DA10.1(A:OUT) DA10.5(B:+IN) R11.16.2
N$273: C3T1.2 C3T2.1 DA10.4(P:V-) DA11.1(R) DA11.2(C) R3.11.1
N$274: R5A.1 R6A.2 R7A.2
N$275: I0.1 R6A.1
N$276: R9A.2 R10A.2
N$277: C2A.2 R1A.2 R2A.2 R8A.1
N$278: R3A.2(S) R4A.1
N$279: I1.1 R1A.1
N$280: DA10.6(B:-IN) DA10.7(B:OUT) R11.17.2 R11.18.1
N$281: R2A.1 R3A.3(E)
N$283: DA2I.6(B:-IN) DA2I.7(B:OUT) OUT_I.1
N$284: R41.SB
N$285: R3I1.1 R3I2.2
N$286: BT1.GND@1(-) R41.B
N$288: BT2.GND@1(-) R3.14.1
N$289: C1I.1 DA1I.6(FILTER)
N$293: DA1I.7(VOUT) R1I.2
N$296: DA2I.3(A:+IN) R1I.1
N$297: DA2I.1(A:OUT) DA2I.5(B:+IN) R3I1.2
N$298: DA2I.2(A:-IN) R2.1I.1 R2.2I.1 R2I1.2 R3I.2
RES13: IC5.1(PB5/PCINT5/!RESET!/ADC0/DW) ISP2.5 R1.2
RESET: ARDUINO1.RST ARDUINO1.RST@1(RST) ISP1.5 ; also sheet 6
RS: ARDUINO1.A3 LCD1.4(.1:RS) LCD1.4@(.1:RS)
RST: ARDUINO1.A1 LCD1.17(.1:RST) LCD1.17@(.1:RST)
RTC7: DD2.7(SQW) R16.1 ; also sheet 4
RXM: ARDUINO1.RX ARDUINO1.RX@1(RX)
SCK: ARDUINO1.D13 ISP1.3 ; also sheet 6
SCK13: IC5.7(PB2/PCINT2/SCK/ADC1/T0) ISP2.3 JLCD1.M.3 JLCD1.M.4 R2.2
SCL: A5.1 DD2.6(SCL) R203.1 ; also sheet 5
SDA: A5.2 DD2.5(SDA) R204.1 ; also sheet 5
TXM: ARDUINO1.TX ARDUINO1.TX@1(TX)
VBAT: DD2.3(VBAT) ; also sheet 5
VMETR: ARDUINO1.A7 C104.2 R114.2 ; also sheet 6
VREF: C102.1 DA1.2(C) R4A.2 R101.2 R102.1 R103.2 R108.2 R112.2
VTAHO: ARDUINO1.A0
Unconnected: ARDUINO1.A4 ARDUINO1.A5 ARDUINO1.DTR ARDUINO1.RAW C17.1 C17.2 DA2.1(A:OUT) DA2.2(A:-IN) DA2.3(A:+IN) DA3.1(A:OUT) DA3.2(A:-IN) DA3.3(A:+IN) DA3.5(B:+IN) DA3.6(B:-IN) DA3.7(B:OUT) DA5.5(B:+IN) DA5.6(B:-IN) DA5.7(B:OUT) IC5.2(PB3/PCINT3/CLKI/ADC3) JLCD1.M.5 JLCD1.M.6 LCD1.16(.1:NC) LCD1.16@(.1:NC) LCD1.18(.1:VOUT) LCD1.18@(.1:VOUT) R6T.1 R41.A R41.SA VT2.1(E) VT2.2(C)

### Buses
DB[0..7],BLK,VMETER,AMETR,ICP1,INT0,E,RS,RST,RESET

### Notes on the sheet
- -22mv
- 3.4v
- +22mv
- 51.1v
- 5.1v
- vin=52v vout=3.409v
  vin=51.1v vout=3.35v adc=1006
  R1+R2=42.76k+3k
- уменьшить ёмкость
- DA2P
- 3.61v
- LM2904
- 3.33v
- [431]
  (TL432)
- 3.335v
- 39.69k
- 3.5v
  R1=1.655k
  R2=3k
  vref=3.885
  aref=3.398
  vin=4.914
- 15.36a 22mv
  1.43*a 
  21.9648mv
- Umax=51.8  Umin=28 Uminux=23.8
  U=ADC*(Umax-Umin)/1024+Umin
- R10(LED) 30R
- IN 15a - OUT 10v
  PowerIN 12.00v
- M
- 3.4v
- 75mv
- rst a1
- tx txm
  rx rxm
  int0 d2
  *t1 db4
  vmeter a7
  ameter a6
  scl a5
  sda a4
  vtaho a0
  *sck d13
  *miso d12
  * aref
  reset
  cristall1
  cristall2
- db7 d10
- db6 d3
- db5 d4
- db4 d5 t
- db3 d6
- db2 d7
- T1 | db1 d11
- db0 d9
- e a2
- rs a3
- 20
- 3.4v | FC-12M
- -22mv
- 22mv
- +1v
- 3.4v | 9.24v
- 7.4v
- 75mv
- 15.36a 22mv
  1.43*a 
  21.9648mv
- 15.36a 22mv
  1.43*a 
  21.9648mv
- B-
- 3.4v
- 22mv

## Sheet 4 of 9: TAHO
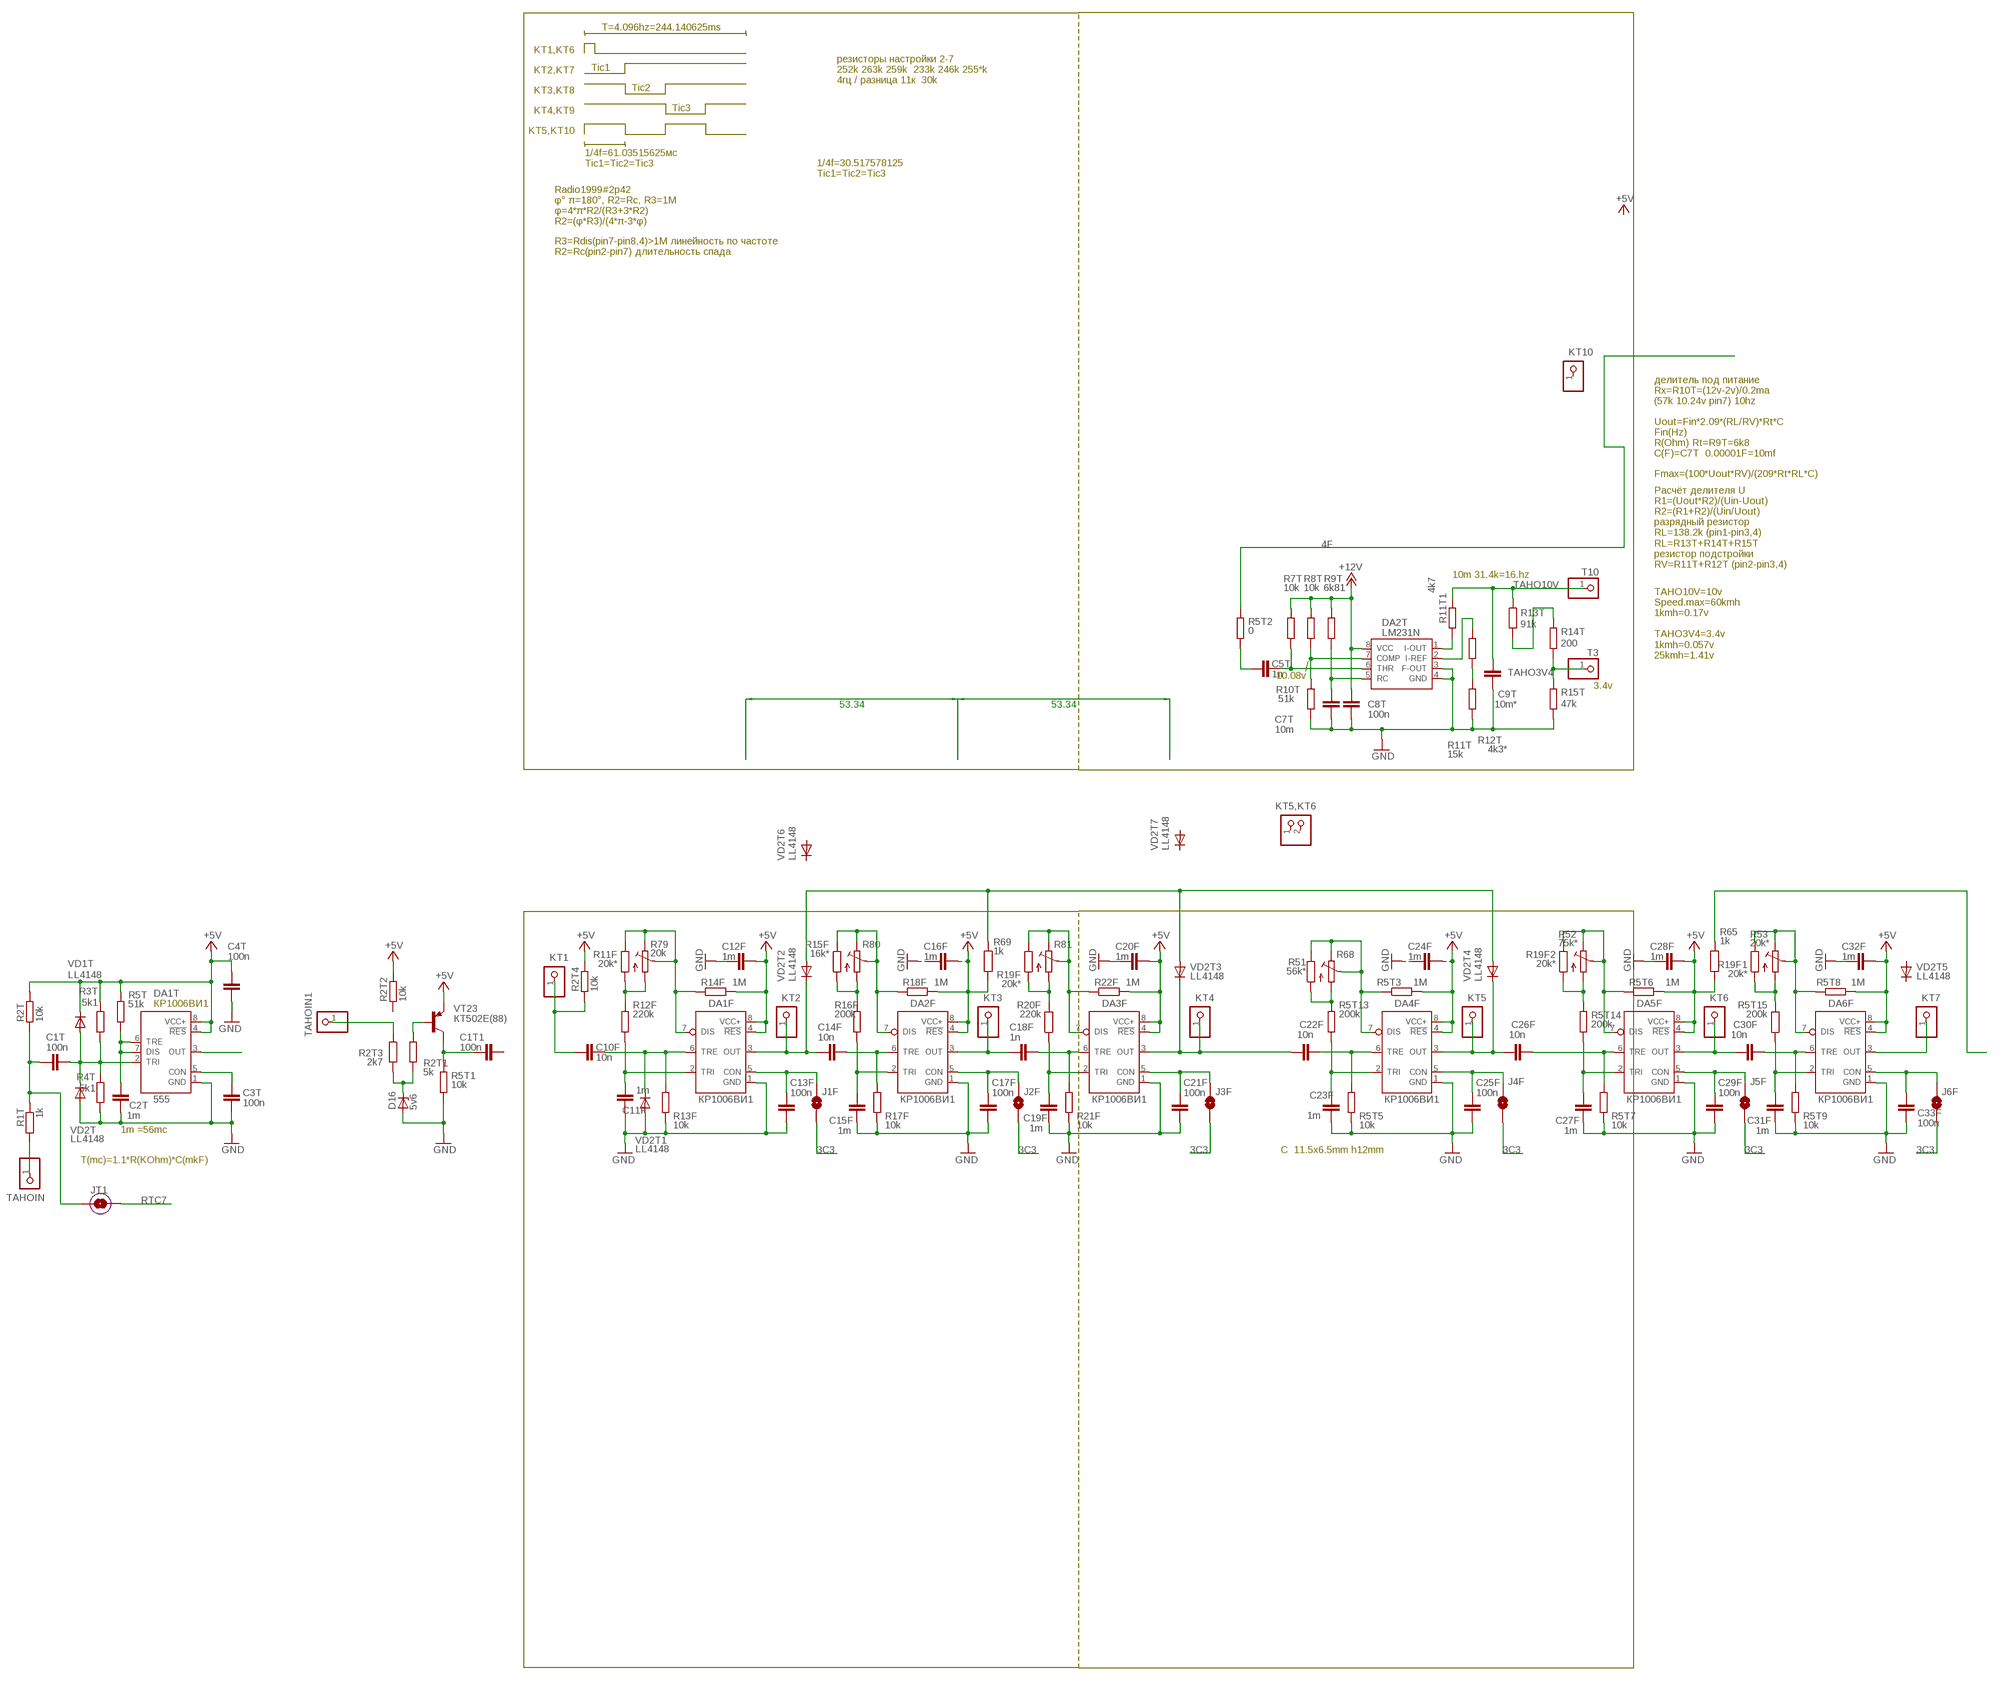
[diagram p4: schematic, sheet 4, part 1 of 3]
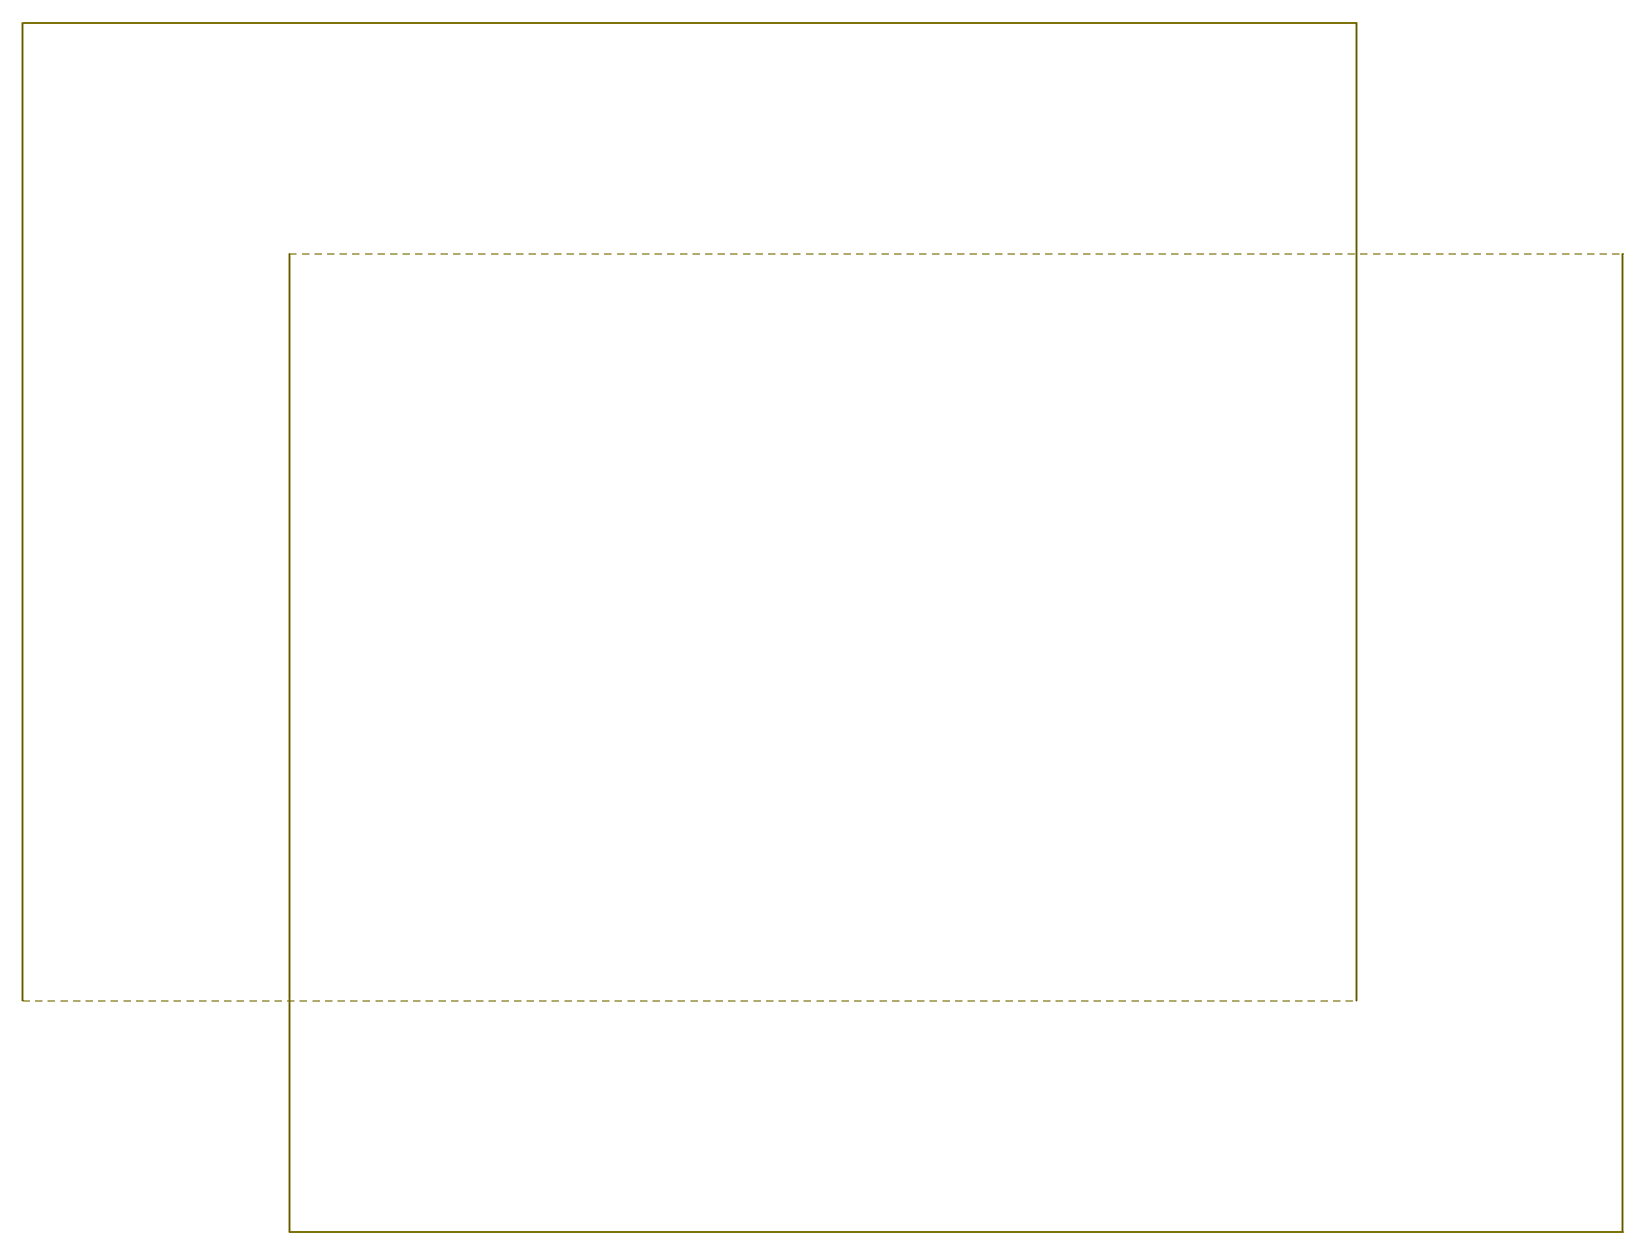
[diagram p5: schematic, sheet 4, part 2 of 3]
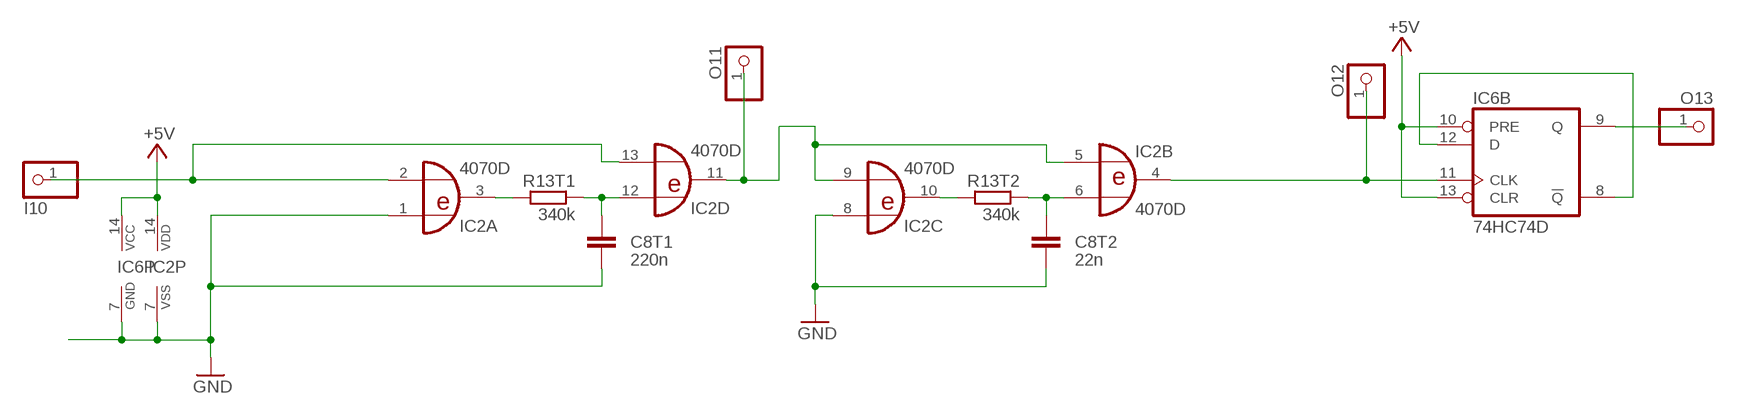
[diagram p6: schematic, sheet 4, part 3 of 3]

### Parts
C1T  100n  C-EUC0805  [C0805]
C1T1  100n  C-EUC0805  [C0805]
C2T  1m  C-EUC0805  [C0805]
C3T  100n  C-EUC0805  [C0805]
C4T  100n  C-EUC0805  [C0805]
C5T  1n  C-EUC0805  [C0805]
C7T  10m  C-EUC3225  [C3225]
C8T  100n  C-EUC0805  [C0805]
C8T1  220n  C-EUC0805  [C0805]
C8T2  22n  C-EUC0805  [C0805]
C9T  10m*  C-EUC3225  [C3225]
C10F  10n  C-EUC0805  [C0805]
C11F  1m  C@H  [C90-065X115H]
C12F  1m  C-EUC0805  [C0805]
C13F  100n  C-EUC0805  [C0805]
C14F  10n  C-EUC0805  [C0805]
C15F  1m  C@H  [C90-065X115H]
C16F  1m  C-EUC0805  [C0805]
C17F  100n  C-EUC0805  [C0805]
C18F  1n  C-EUC0805  [C0805]
C19F  1m  C@H  [C90-065X115H]
C20F  1m  C-EUC0805  [C0805]
C21F  100n  C-EUC0805  [C0805]
C22F  10n  C-EUC0805  [C0805]
C23F  1m  C@H  [C90-065X115H]
C24F  1m  C-EUC0805  [C0805]
C25F  100n  C-EUC0805  [C0805]
C26F  10n  C-EUC0805  [C0805]
C27F  1m  C@H  [C90-065X115H]
C28F  1m  C-EUC0805  [C0805]
C29F  100n  C-EUC0805  [C0805]
C30F  10n  C-EUC0805  [C0805]
C31F  1m  C@H  [C90-065X115H]
C32F  1m  C-EUC0805  [C0805]
C33F  100n  C-EUC0805  [C0805]
D16  5v6  ZENER-DIODESOD80C  [SOD80C]
DA1F  КР1006ВИ1  555N  [DIL8]
DA1T  555  [DIL-08]
DA2F  КР1006ВИ1  555N  [DIL8]
DA2T  LM231N  LM331N  [DIL08]
DA3F  КР1006ВИ1  555N  [DIL8]
DA4F  КР1006ВИ1  555N  [DIL8]
DA5F  КР1006ВИ1  555N  [DIL8]
DA6F  КР1006ВИ1  555N  [DIL8]
I10  PINHD-1X1  [1X01]
IC2  4070D  [SO14]
IC6  74HC74D  [SO14]
J1F  SJ  [SJ]
J2F  SJ  [SJ]
J3F  SJ  [SJ]
J4F  SJ  [SJ]
J5F  SJ  [SJ]
J6F  SJ  [SJ]
JT1  SJ  [SJ]
KT1  PINHD-1X1  [1X01]
KT2  PINHD-1X1  [1X01]
KT3  PINHD-1X1  [1X01]
KT4  PINHD-1X1  [1X01]
KT5  PINHD-1X1  [1X01]
KT5,KT6  PINHD-1X2/2  [1X02]
KT6  PINHD-1X1  [1X01]
KT7  PINHD-1X1  [1X01]
KT10  PINHD-1X1  [1X01]
O11  PINHD-1X1  [1X01]
O12  PINHD-1X1  [1X01]
O13  PINHD-1X1  [1X01]
R1T  1k  R-EU_R0805  [R0805]
R2T  10k  R-EU_R0805  [R0805]
R2T1  5k  R-EU_R0805  [R0805]
R2T2  10k  R-EU_R0805  [R0805]
R2T3  2k7  R-EU_R0805  [R0805]
R2T4  10k  R-EU_R0805  [R0805]
R3T  5k1  R-EU_R0805  [R0805]
R4T  5k1  R-EU_R0805  [R0805]
R5T  51k  R-EU_R0805  [R0805]
R5T1  10k  R-EU_R0805  [R0805]
R5T2  0  R-EU_R0805  [R0805]
R5T3  1M  R-EU_R0805  [R0805]
R5T5  10k  R-EU_R0805  [R0805]
R5T6  1M  R-EU_R0805  [R0805]
R5T7  10k  R-EU_R0805  [R0805]
R5T8  1M  R-EU_R0805  [R0805]
R5T9  10k  R-EU_R0805  [R0805]
R5T13  200k  R-EU_R0805  [R0805]
R5T14  200k  R-EU_R0805  [R0805]
R5T15  200k  R-EU_R0805  [R0805]
R7T  10k  R-EU_R0805  [R0805]
R8T  10k  R-EU_R0805  [R0805]
R9T  6k81  R-EU_R0805  [R0805]
R10T  51k  R-EU_R0805  [R0805]
R11F  20k*  R-EU_0207/10  [0207/10]
R11T  15k  R-EU_R0805  [R0805]
R11T1  4k7  R-EU_R0805  [R0805]
R12F  220k  R-EU_R0805  [R0805]
R12T  4k3*  R-EU_R0805  [R0805]
R13F  10k  R-EU_R0805  [R0805]
R13T  91k  R-EU_R0805  [R0805]
R13T1  340k  R-EU_R0805  [R0805]
R13T2  340k  R-EU_R0805  [R0805]
R14F  1M  R-EU_R0805  [R0805]
R14T  200  R-EU_R0805  [R0805]
R15F  16k*  R-EU_0207/10  [0207/10]
R15T  47k  R-EU_R0805  [R0805]
R16F  200k  R-EU_R0805  [R0805]
R17F  10k  R-EU_R0805  [R0805]
R18F  1M  R-EU_R0805  [R0805]
R19F  20k*  R-EU_0207/10  [0207/10]
R19F1  20k*  R-EU_0207/11  [0207/11]
R19F2  20k*  R-EU_0207/10  [0207/10]
R20F  220k  R-EU_R0805  [R0805]
R21F  10k  R-EU_R0805  [R0805]
R22F  1M  R-EU_R0805  [R0805]
R51  56k*  R-EU_0207/10  [0207/10]
R52  75k*  R-TRIMM3314GJ  [RTRIM3314GJ]
R53  20k*  R-TRIMM3314G  [RTRIM3314G]
R65  1k  R-EU_R0805  [R0805]
R68  R-TRIMM3314GJ  [RTRIM3314GJ]
R69  1k  R-EU_R0805  [R0805]
R79  20k  R-TRIMM3314GJ  [RTRIM3314GJ]
R80  R-TRIMM3314GJ  [RTRIM3314GJ]
R81  R-TRIMM3314GJ  [RTRIM3314GJ]
T3  PINHD-1X1  [1X01]
T10  PINHD-1X1  [1X01]
TAHOIN  PINHD-1X1  [1X01]
TAHOIN1  PINHD-1X1  [1X01]
VD1T  LL4148  DIODE-SOD80C  [SOD80C]
VD2T  LL4148  DIODE-SOD80C  [SOD80C]
VD2T1  LL4148  DIODE-SOD80C  [SOD80C]
VD2T2  LL4148  DIODE-SOD80C  [SOD80C]
VD2T3  LL4148  DIODE-SOD80C  [SOD80C]
VD2T4  LL4148  DIODE-SOD80C  [SOD80C]
VD2T5  LL4148  DIODE-SOD80C  [SOD80C]
VD2T6  LL4148  DIODE-SOD80C  [SOD80C]
VD2T7  LL4148  DIODE-SOD80C  [SOD80C]
VT23  КТ502Е(88)  BJT_PNP_TO-92_CBE  [TO92]

### Nets
2F: R69.1 VD2T2.A VD2T3.A VD2T4.A
3C3: J1F.2 J2F.2 J3F.2 J4F.2 J5F.2 J6F.2
4F: R5T2.2
+5V: C4T.1 C12F.1 C16F.1 C20F.1 C24F.2 C28F.1 C32F.1 DA1F.4(!RES) DA1F.8(VCC+) DA1T.4(!RES) DA1T.8(VCC+) DA2F.4(!RES) DA2F.8(VCC+) DA3F.4(!RES) DA3F.8(VCC+) DA4F.4(!RES) DA4F.8(VCC+) DA5F.4(!RES) DA5F.8(VCC+) DA6F.4(!RES) DA6F.8(VCC+) IC2.14(P:VDD) IC6.10(B:PRE) IC6.13(B:CLR) IC6.14(P:VCC) R2T2.2 R2T4.2 R2T.2 R3T.2 R5T3.2 R5T6.2 R5T8.1 R5T.2 R14F.2 R18F.2 R22F.2 R65.2 R69.2 VD1T.C VT23.3(E) ; also sheet 2,3,6,9
+12V: C8T.1 DA2T.8(VCC) R7T.2 R8T.2 R9T.2 ; also sheet 2,3,6
GND: C2T.2 C3T.2 C4T.2 C7T.2 C8T1.2 C8T2.2 C8T.2 C9T.2 C11F.1 C12F.2 C13F.2 C15F.2 C16F.2 C17F.2 C19F.2 C20F.2 C21F.2 C23F.2 C24F.1 C25F.2 C27F.2 C28F.2 C29F.2 C31F.2 C32F.2 C33F.2 D16.A DA1F.1(GND) DA1T.1(GND) DA2F.1(GND) DA2T.3(F-OUT) DA2T.4(GND) DA3F.1(GND) DA4F.1(GND) DA5F.1(GND) DA6F.1(GND) IC2.1(A:I0) IC2.7(P:VSS) IC2.8(C:I0) IC6.7(P:GND) R4T.1 R5T1.1 R5T5.1 R5T7.1 R5T9.1 R10T.1 R12T.1 R13F.1 R15T.1 R17F.1 R21F.1 VD2T1.A VD2T.A ; also sheet 1,2,3,5,6,8,9
N$12: C1T.1 JT1.1 R1T.1 R2T.1
N$14: C25F.1 DA4F.5(CON) J4F.1
N$15: C3T.1 DA1T.5(CON)
N$16: D16.C R2T1.1 R2T3.2
N$27: C2T.1 DA1T.6(TRE) DA1T.7(DIS) R5T.1
N$95: C23F.1 DA4F.2(TRI) R5T13.1
N$116: C1T1.1 R5T1.2 VT23.1(C)
N$123: R2T1.2 VT23.2(B)
N$124: R2T3.1 TAHOIN1.1
N$125: C11F.2 DA1F.2(TRI) R12F.1
N$126: R1T.2 TAHOIN.1
N$214: C1T.2 DA1T.2(TRI) R3T.1 R4T.2 VD1T.A VD2T.C
N$304: I10.1 IC2.2(A:I1) IC2.13(D:I1)
N$307: C7T.1 DA2T.5(RC) R9T.1
N$308: DA2T.7(COMP) R8T.1 R10T.2
N$310: DA2T.2(I-REF) R11T.2
N$312: R13T.2 R14T.2
N$313: C5T.2 DA2T.6(THR) R7T.1
N$314: DA1F.7(DIS) R11F.2 R14F.1 R79.1(E) R79.1A(E) R79.2(S)
N$315: C10F.2 DA1F.6(TRE) R13F.2 VD2T1.C
N$317: C17F.1 DA2F.5(CON) J2F.1
N$318: R11F.1 R12F.2 R79.3(A) R79.3A(A)
N$319: C15F.1 DA2F.2(TRI) R16F.1
N$320: R11T.1 R12T.2
N$321: DA2F.7(DIS) R15F.2 R18F.1 R80.1(E) R80.1A(E) R80.2(S)
N$322: C13F.1 DA1F.5(CON) J1F.1
N$323: C21F.1 DA3F.5(CON) J3F.1
N$324: R15F.1 R16F.2 R80.3(A) R80.3A(A)
N$325: C19F.1 DA3F.2(TRI) R20F.1
N$326: DA3F.7(DIS) R19F.2 R22F.1 R81.1(E) R81.1A(E) R81.2(S)
N$327: C18F.2 DA3F.6(TRE) R21F.2
N$328: C14F.2 DA2F.6(TRE) R17F.2
N$329: R19F.1 R20F.2 R81.3(A) R81.3A(A)
N$330: C5T.1 R5T2.1
N$331: C10F.1 KT1.1 R2T4.1
N$333: R65.1
N$336: C22F.1 DA3F.3(OUT) KT4.1 VD2T3.C
N$338: C18F.1 DA2F.3(OUT) KT3.1
N$341: C29F.1 DA5F.5(CON) J5F.1
N$342: C14F.1 DA1F.3(OUT) KT2.1 VD2T2.C
N$345: DA1T.3(OUT)
N$346: C33F.1 DA6F.5(CON) J6F.1
N$347: DA6F.3(OUT) KT7.1
N$348: IC2.4(B:O) IC6.11(B:CLK) O12.1
N$349: IC2.3(A:O) R13T1.2
N$350: C8T1.1 IC2.12(D:I0) R13T1.1
N$351: IC6.8(B:!Q) IC6.12(B:D)
N$352: IC2.10(C:O) R13T2.2
N$353: DA2T.1(I-OUT) R11T1.1
N$354: IC2.5(B:I0) IC2.9(C:I1) IC2.11(D:O) O11.1
N$355: C8T2.1 IC2.6(B:I1) R13T2.1
N$356: R5T13.2 R51.1 R68.3(A) R68.3A(A)
N$358: R5T14.2 R19F2.1 R52.3(A) R52.3A(A)
N$359: IC6.9(B:Q) O13.1
N$361: DA4F.7(DIS) R5T3.1 R51.2 R68.1(E) R68.1A(E) R68.2(S)
N$362: C26F.1 DA4F.3(OUT) KT5.1 VD2T4.C
N$367: R5T15.2 R19F1.1 R53.3(A)
N$391: C22F.2 DA4F.6(TRE) R5T5.2
N$417: C27F.1 DA5F.2(TRI) R5T14.1
N$419: DA5F.7(DIS) R5T6.1 R19F2.2 R52.1(E) R52.1A(E) R52.2(S)
N$420: C26F.2 DA5F.6(TRE) R5T7.2
N$423: C31F.1 DA6F.2(TRI) R5T15.1
N$425: DA6F.7(DIS) R5T8.2 R19F1.2 R53.1(E) R53.2(S)
N$426: C30F.2 DA6F.6(TRE) R5T9.2
N$427: C30F.1 DA5F.3(OUT) KT6.1
RTC7: JT1.2 ; also sheet 3
TAHO3V4: R14T.1 R15T.2 T3.1
TAHO10V: C9T.1 R11T1.2 R13T.1 T10.1
Unconnected: C1T1.2 IC6.1(A:CLR) IC6.2(A:D) IC6.3(A:CLK) IC6.4(A:PRE) IC6.5(A:Q) IC6.6(A:!Q) KT5,KT6.1 KT5,KT6.2 KT10.1 R2T2.1 VD2T5.A VD2T5.C VD2T6.A VD2T6.C VD2T7.A VD2T7.C

### Notes on the sheet
- T=4.096hz=244.140625ms
- KT1,KT6
- KT2,KT7 | Tic1
- резисторы настройки 2-7
  252k 263k 259k  233k 246k 255*k
  4гц / разница 11к  30k
- KT3,KT8 | Tic2
- KT4,KT9 | Tic3
- KT5,KT10
- 1/4f=61.03515625мс
  Tic1=Tic2=Tic3
- 1/4f=30.517578125
  Tic1=Tic2=Tic3
- Radio1999#2p42
  φ° π=180°, R2=Rc, R3=1M
  φ=4*π*R2/(R3+3*R2)
  R2=(φ*R3)/(4*π-3*φ)
- R3=Rdis(pin7-pin8,4)>1M линейность по частоте
  R2=Rc(pin2-pin7) длительность спада
- делитель под питание
  Rx=R10T=(12v-2v)/0.2ma
  (57k 10.24v pin7) 10hz
- Uout=Fin*2.09*(RL/RV)*Rt*C
  Fin(Hz)
  R(Ohm) Rt=R9T=6k8
  C(F)=C7T  0.00001F=10mf
- Fmax=(100*Uout*RV)/(209*Rt*RL*C)
- Расчёт делителя U
  R1=(Uout*R2)/(Uin-Uout)
  R2=(R1+R2)/(Uin/Uout)
  разрядный резистор
  RL=138.2k (pin1-pin3,4)
  RL=R13T+R14T+R15T
  резистор подстройки
  RV=R11T+R12T (pin2-pin3,4)
- 10m 31.4k=16.hz
- TAHO10V=10v
  Speed.max=60kmh
  1kmh=0.17v
  
  TAHO3V4=3.4v
  1kmh=0.057v
  25kmh=1.41v
- 10.08v
- 3.4v
- КР1006ВИ1
- 1m =56mc
- C  11.5x6.5mm h12mm
- Т(mc)=1.1*R(KOhm)*С(mkF)

## Sheet 5 of 9
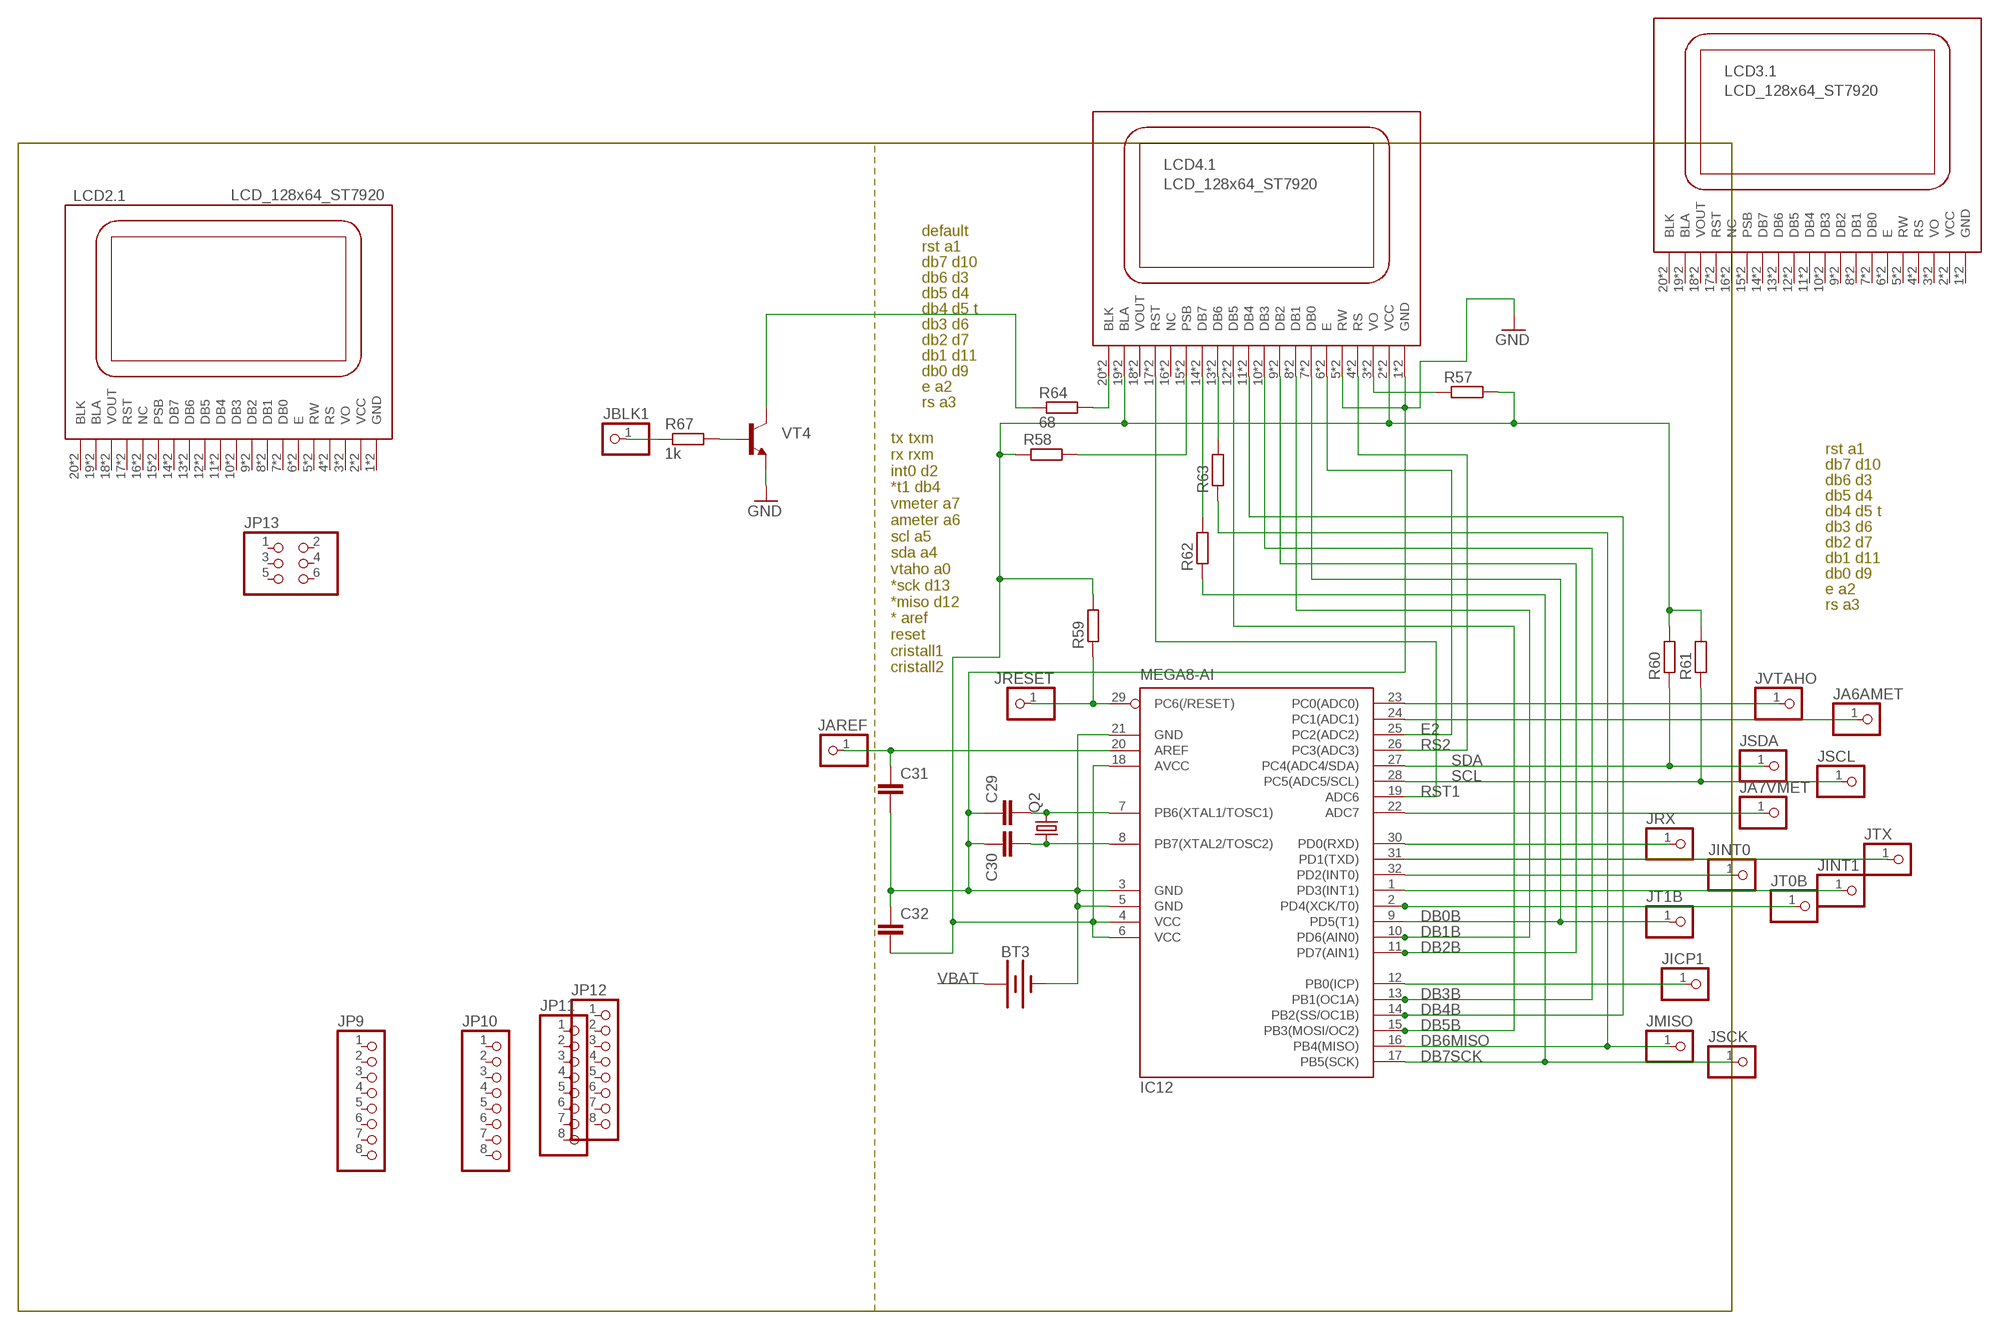
[diagram p7: schematic, sheet 5]

### Parts
BT3  BATTERY-20MM_PTH  [BATTCOM_20MM_PTH]
C29  C-EUC0805  [C0805]
C30  C-EUC0805  [C0805]
C31  C-EUC0805  [C0805]
C32  C-EUC0805  [C0805]
IC12  MEGA8-AI  [TQFP32-08]
JA6AMET  PINHD-1X1  [1X01]
JA7VMET  PINHD-1X1  [1X01]
JAREF  PINHD-1X1  [1X01]
JBLK1  PINHD-1X1  [1X01]
JICP1  PINHD-1X1  [1X01]
JINT0  PINHD-1X1  [1X01]
JINT1  PINHD-1X1  [1X01]
JMISO  PINHD-1X1  [1X01]
JP9  PINHD-1X8  [1X08]
JP10  PINHD-1X8  [1X08]
JP11  PINHD-1X8  [1X08]
JP12  PINHD-1X8  [1X08]
JP13  PINHD-2X3/90  [2X03/90]
JRESET  PINHD-1X1  [1X01]
JRX  PINHD-1X1  [1X01]
JSCK  PINHD-1X1  [1X01]
JSCL  PINHD-1X1  [1X01]
JSDA  PINHD-1X1  [1X01]
JT0B  PINHD-1X1  [1X01]
JT1B  PINHD-1X1  [1X01]
JTX  PINHD-1X1  [1X01]
JVTAHO  PINHD-1X1  [1X01]
LCD2  LCD_128x64_ST7920  12864B  [12864B]
LCD3  LCD_128x64_ST7920  12864B  [12864B]
LCD4  LCD_128x64_ST7920  12864B  [12864B]
Q2  CRYSTALHC49S  [HC49/S]
R57  R-EU_R0805  [R0805]
R58  R-EU_R0805  [R0805]
R59  R-EU_R0805  [R0805]
R60  R-EU_R0805  [R0805]
R61  R-EU_R0805  [R0805]
R62  R-EU_R0603  [R0603]
R63  R-EU_R0603  [R0603]
R64  68  R-EU_R0805  [R0805]
R67  1k  R-EU_R0805  [R0805]
VT4  BJT_NPN_SOT23_BCE  [SOT23]

### Nets
DB0B: IC12.9(PD5(T1)) JT1B.1 LCD4.7(.1:DB0) LCD4.7@(.1:DB0)
DB1B: IC12.10(PD6(AIN0)) LCD4.8(.1:DB1) LCD4.8@(.1:DB1)
DB2B: IC12.11(PD7(AIN1)) LCD4.9(.1:DB2) LCD4.9@(.1:DB2)
DB3B: IC12.13(PB1(OC1A)) LCD4.10(.1:DB3) LCD4.10@(.1:DB3)
DB4B: IC12.14(PB2(SS/OC1B)) LCD4.11(.1:DB4) LCD4.11@(.1:DB4)
DB5B: IC12.15(PB3(MOSI/OC2)) LCD4.12(.1:DB5) LCD4.12@(.1:DB5)
DB6MISO: IC12.16(PB4(MISO)) JMISO.1 R63.1
DB7SCK: IC12.17(PB5(SCK)) JSCK.1 R62.1
E2: IC12.25(PC2(ADC2)) LCD4.6(.1:E) LCD4.6@(.1:E)
GND: BT3.2(-) C29.1 C30.1 C31.2 C32.1 IC12.3(GND) IC12.5(GND) IC12.21(GND) LCD4.1(.1:GND) LCD4.1@(.1:GND) LCD4.5(.1:RW) LCD4.5@(.1:RW) VT4.2(E) ; also sheet 1,2,3,4,6,8,9
N$332: R67.2 VT4.1(B)
N$334: R64.1 VT4.3(C)
N$335: JBLK1.1 R67.1
N$424: LCD4.3(.1:VO) LCD4.3@(.1:VO) R57.1
N$430: IC12.32(PD2(INT0)) JINT0.1
N$431: IC12.12(PB0(ICP)) JICP1.1
N$432: LCD4.15(.1:PSB) LCD4.15@(.1:PSB) R58.2
N$433: IC12.2(PD4(XCK/T0)) JT0B.1
N$434: IC12.30(PD0(RXD)) JRX.1
N$435: IC12.22(ADC7) JA7VMET.1
N$436: IC12.24(PC1(ADC1)) JA6AMET.1
N$439: IC12.29(PC6(/RESET)) JRESET.1 R59.1
N$440: IC12.23(PC0(ADC0)) JVTAHO.1
N$441: LCD4.14(.1:DB7) LCD4.14@(.1:DB7) R62.2
N$442: C29.2 IC12.7(PB6(XTAL1/TOSC1)) Q2.2
N$443: C30.2 IC12.8(PB7(XTAL2/TOSC2)) Q2.1
N$444: LCD4.13(.1:DB6) LCD4.13@(.1:DB6) R63.2
N$445: IC12.1(PD3(INT1)) JINT1.1
N$446: LCD4.20(.1:BLK) LCD4.20@(.1:BLK) R64.2
N$448: IC12.31(PD1(TXD)) JTX.1
N$449: C31.1 IC12.20(AREF) JAREF.1
RS2: IC12.26(PC3(ADC3)) LCD4.4(.1:RS) LCD4.4@(.1:RS)
RST1: IC12.19(ADC6) LCD4.17(.1:RST) LCD4.17@(.1:RST)
SCL: IC12.28(PC5(ADC5/SCL)) JSCL.1 R61.1 ; also sheet 3
SDA: IC12.27(PC4(ADC4/SDA)) JSDA.1 R60.1 ; also sheet 3
VBAT: BT3.1(+) ; also sheet 3
VCCV2: C32.2 IC12.4(VCC) IC12.6(VCC) IC12.18(AVCC) LCD4.2(.1:VCC) LCD4.2@(.1:VCC) LCD4.19(.1:BLA) LCD4.19@(.1:BLA) R57.2 R58.1 R59.2 R60.2 R61.2
Unconnected: JP9.1 JP9.2 JP9.3 JP9.4 JP9.5 JP9.6 JP9.7 JP9.8 JP10.1 JP10.2 JP10.3 JP10.4 JP10.5 JP10.6 JP10.7 JP10.8 JP11.1 JP11.2 JP11.3 JP11.4 JP11.5 JP11.6 JP11.7 JP11.8 JP12.1 JP12.2 JP12.3 JP12.4 JP12.5 JP12.6 JP12.7 JP12.8 JP13.1 JP13.2 JP13.3 JP13.4 JP13.5 JP13.6 LCD2.1(.1:GND) LCD2.1@(.1:GND) LCD2.2(.1:VCC) LCD2.2@(.1:VCC) LCD2.3(.1:VO) LCD2.3@(.1:VO) LCD2.4(.1:RS) LCD2.4@(.1:RS) LCD2.5(.1:RW) LCD2.5@(.1:RW) LCD2.6(.1:E) LCD2.6@(.1:E) LCD2.7(.1:DB0) LCD2.7@(.1:DB0) LCD2.8(.1:DB1) LCD2.8@(.1:DB1) LCD2.9(.1:DB2) LCD2.9@(.1:DB2) LCD2.10(.1:DB3) LCD2.10@(.1:DB3) LCD2.11(.1:DB4) LCD2.11@(.1:DB4) LCD2.12(.1:DB5) LCD2.12@(.1:DB5) LCD2.13(.1:DB6) LCD2.13@(.1:DB6) LCD2.14(.1:DB7) LCD2.14@(.1:DB7) LCD2.15(.1:PSB) LCD2.15@(.1:PSB) LCD2.16(.1:NC) LCD2.16@(.1:NC) LCD2.17(.1:RST) LCD2.17@(.1:RST) LCD2.18(.1:VOUT) LCD2.18@(.1:VOUT) LCD2.19(.1:BLA) LCD2.19@(.1:BLA) LCD2.20(.1:BLK) LCD2.20@(.1:BLK) LCD2.21 LCD2.22 LCD2.23 LCD2.24 LCD2.25 LCD2.26 LCD3.1(.1:GND) LCD3.1@(.1:GND) LCD3.2(.1:VCC) LCD3.2@(.1:VCC) LCD3.3(.1:VO) LCD3.3@(.1:VO) LCD3.4(.1:RS) LCD3.4@(.1:RS) LCD3.5(.1:RW) LCD3.5@(.1:RW) LCD3.6(.1:E) LCD3.6@(.1:E) LCD3.7(.1:DB0) LCD3.7@(.1:DB0) LCD3.8(.1:DB1) LCD3.8@(.1:DB1) LCD3.9(.1:DB2) LCD3.9@(.1:DB2) LCD3.10(.1:DB3) LCD3.10@(.1:DB3) LCD3.11(.1:DB4) LCD3.11@(.1:DB4) LCD3.12(.1:DB5) LCD3.12@(.1:DB5) LCD3.13(.1:DB6) LCD3.13@(.1:DB6) LCD3.14(.1:DB7) LCD3.14@(.1:DB7) LCD3.15(.1:PSB) LCD3.15@(.1:PSB) LCD3.16(.1:NC) LCD3.16@(.1:NC) LCD3.17(.1:RST) LCD3.17@(.1:RST) LCD3.18(.1:VOUT) LCD3.18@(.1:VOUT) LCD3.19(.1:BLA) LCD3.19@(.1:BLA) LCD3.20(.1:BLK) LCD3.20@(.1:BLK) LCD3.21 LCD3.22 LCD3.23 LCD3.24 LCD3.25 LCD3.26 LCD4.16(.1:NC) LCD4.16@(.1:NC) LCD4.18(.1:VOUT) LCD4.18@(.1:VOUT) LCD4.21 LCD4.22 LCD4.23 LCD4.24 LCD4.25 LCD4.26

### Notes on the sheet
- default
- rst a1
- db7 d10
- db6 d3
- db5 d4
- db4 d5 t
- db3 d6
- db2 d7
- db1 d11
- db0 d9
- e a2
- rs a3
- rst a1
- db7 d10
- db6 d3
- db5 d4
- db4 d5 t
- db3 d6
- db2 d7
- db1 d11
- db0 d9
- e a2
- rs a3
- tx txm
  rx rxm
  int0 d2
  *t1 db4
  vmeter a7
  ameter a6
  scl a5
  sda a4
  vtaho a0
  *sck d13
  *miso d12
  * aref
  reset
  cristall1
  cristall2

## Sheet 6 of 9
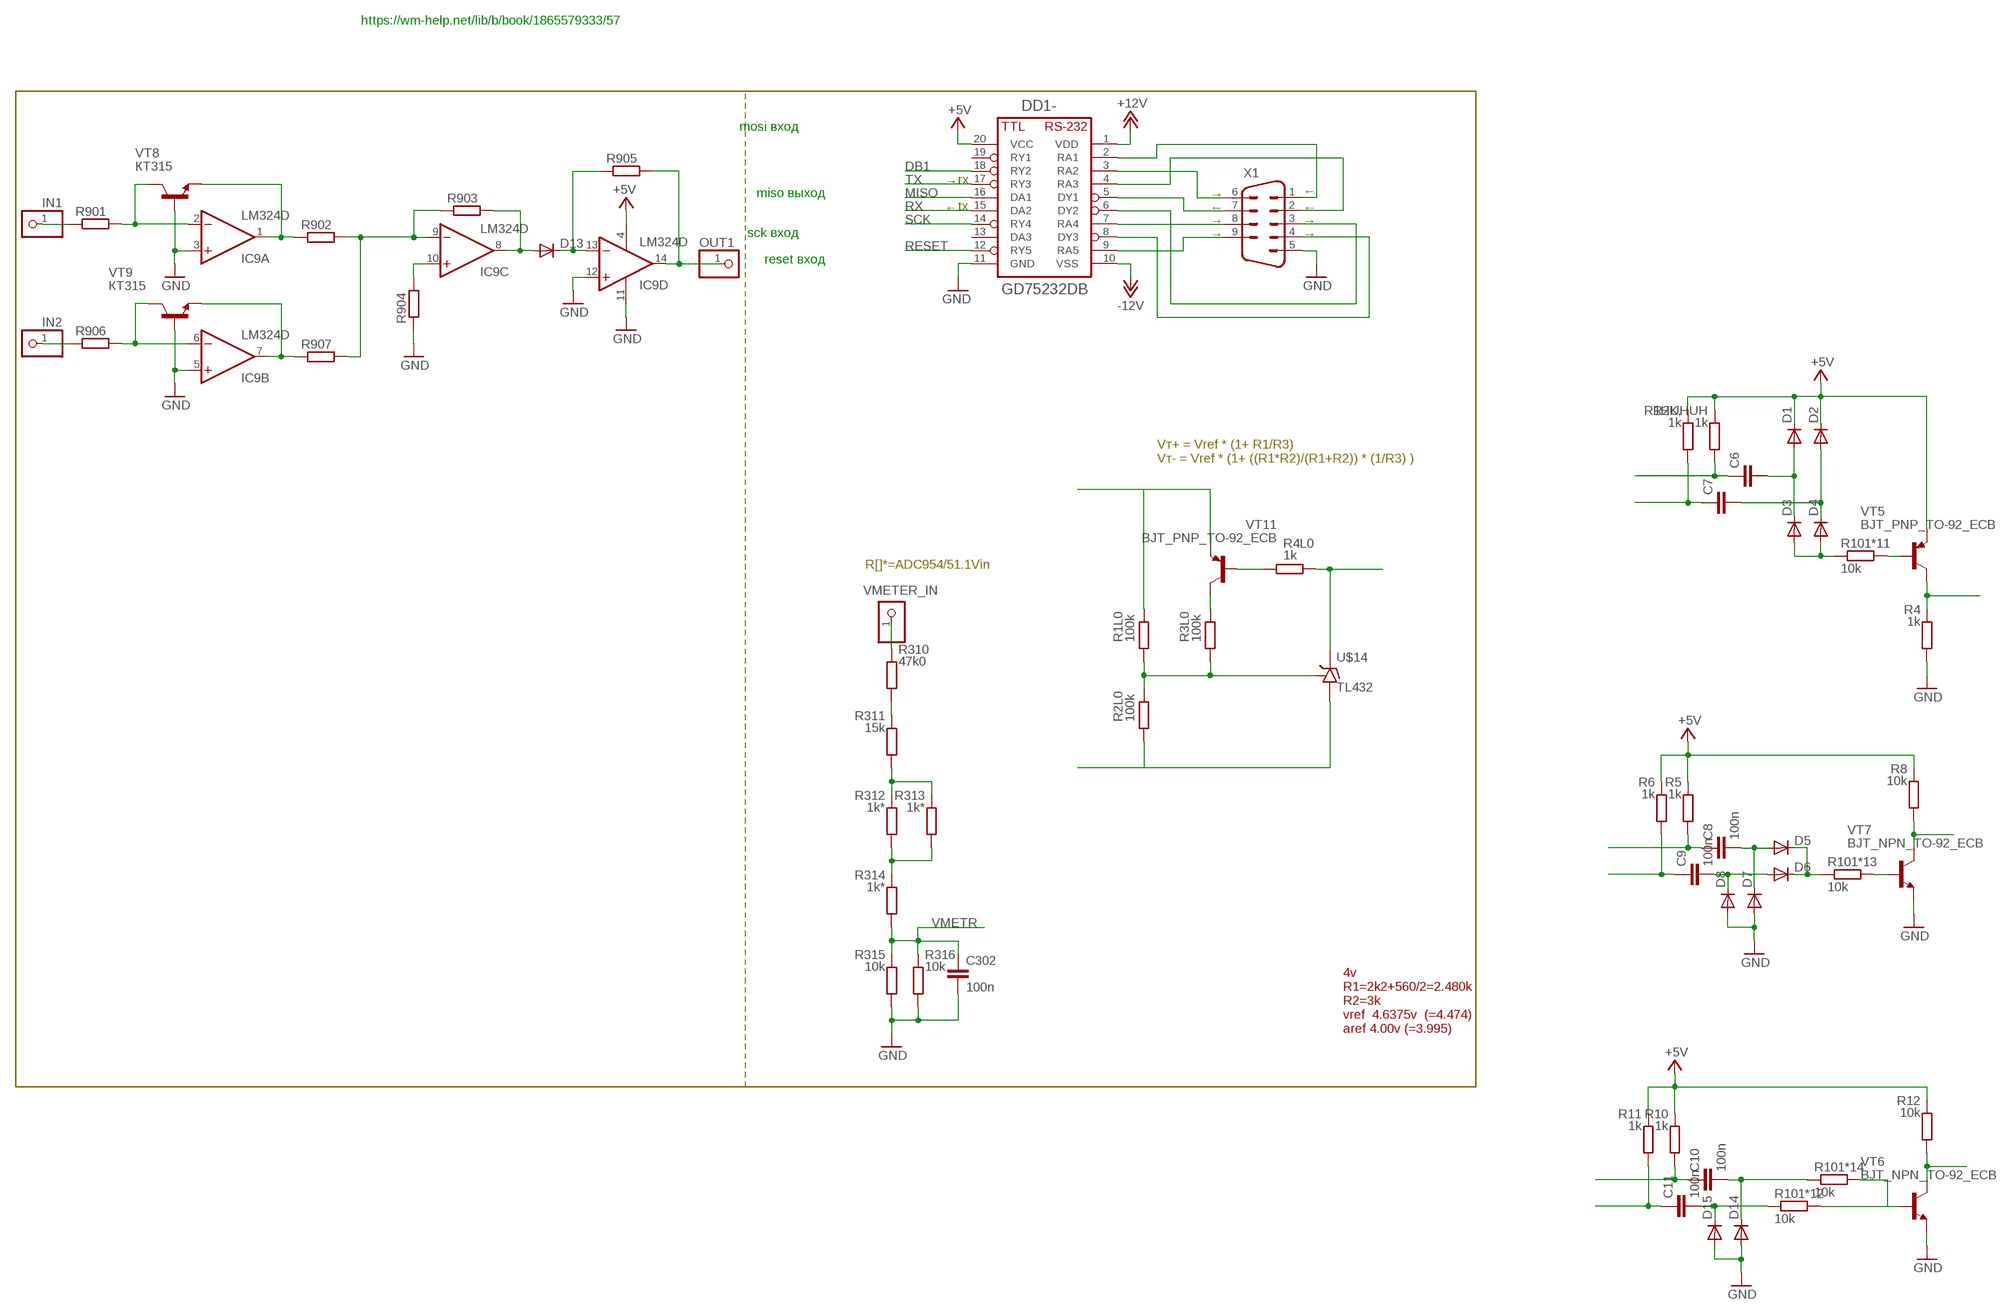
[diagram p8: schematic, sheet 6]

### Parts
C6  C-EUC0805  [C0805]
C7  C-EUC0805  [C0805]
C8  100n  C-EUC0805  [C0805]
C9  100n  C-EUC0805  [C0805]
C10  100n  C-EUC0805  [C0805]
C11  100n  C-EUC0805  [C0805]
C302  100n  C-EUC0805  [C0805]
D1  DIODE-SOD80C  [SOD80C]
D2  DIODE-SOD80C  [SOD80C]
D3  DIODE-SOD80C  [SOD80C]
D4  DIODE-SOD80C  [SOD80C]
D5  DIODE-SOD80C  [SOD80C]
D6  DIODE-SOD80C  [SOD80C]
D7  DIODE-SOD80C  [SOD80C]
D8  DIODE-SOD80C  [SOD80C]
D13  DIODE-SOD80C  [SOD80C]
D14  DIODE-SOD80C  [SOD80C]
D15  DIODE-SOD80C  [SOD80C]
DD1-  GD75232DB  75232DB  [SSOP20D8]
IC9  LM324D  [SO14]
IN1  PINHD-1X1  [1X01]
IN2  PINHD-1X1  [1X01]
OUT1  PINHD-1X1  [1X01]
R1HUHUH  1k  R-EU_R0805  [R0805]
R1L0  100k  R-EU_R0805  [R0805]
R2K,  1k  R-EU_R0805  [R0805]
R2L0  100k  R-EU_R0805  [R0805]
R3L0  100k  R-EU_R0805  [R0805]
R4  1k  R-EU_R0805  [R0805]
R4L0  1k  R-EU_R0805  [R0805]
R5  1k  R-EU_R0805  [R0805]
R6  1k  R-EU_R0805  [R0805]
R8  10k  R-EU_R0805  [R0805]
R10  1k  R-EU_R0805  [R0805]
R11  1k  R-EU_R0805  [R0805]
R12  10k  R-EU_R0805  [R0805]
R101*11  10k  R-EU_R0805  [R0805]
R101*12  10k  R-EU_R0805  [R0805]
R101*13  10k  R-EU_R0805  [R0805]
R101*14  10k  R-EU_R0805  [R0805]
R310  47k0  R-EU_R0805  [R0805]
R311  15k  R-EU_R0805  [R0805]
R312  1k*  R-EU_R0805  [R0805]
R313  1k*  R-EU_R0805  [R0805]
R314  1k*  R-EU_R0805  [R0805]
R315  10k  R-EU_R0805  [R0805]
R316  10k  R-EU_R0805  [R0805]
R901  R-EU_R0805  [R0805]
R902  R-EU_R0805  [R0805]
R903  R-EU_R0805  [R0805]
R904  R-EU_R0805  [R0805]
R905  R-EU_R0805  [R0805]
R906  R-EU_R0805  [R0805]
R907  R-EU_R0805  [R0805]
U$14  TL432  [SOT-23]
VMETER_IN  PINHD-1X1  [1X01]
VT5  BJT_PNP_TO-92_ECB  [TO92]
VT6  BJT_NPN_TO-92_ECB  [TO92]
VT7  BJT_NPN_TO-92_ECB  [TO92]
VT8  КТ315  BJT_NPN_TO-92_ECB  [TO92]
VT9  КТ315  BJT_NPN_TO-92_ECB  [TO92]
VT11  BJT_PNP_TO-92_ECB  [TO92]
X1  M09-182  [182-009-MALE]

### Nets
+5V: D1.C D2.C DD1-.20(VCC) IC9.4(P:V+) R1HUHUH.2 R2K,.2 R5.2 R6.2 R8.2 R10.2 R11.2 R12.2 VT5.1(E) ; also sheet 2,3,4,9
+12V: DD1-.1(VDD) ; also sheet 2,3,4
-12V: DD1-.10(VSS)
DB1: DD1-.18(RY2) ; also sheet 3
GND: C302.2 D7.A D8.A D14.A D15.A DD1-.11(GND) IC9.3(A:+IN) IC9.5(B:+IN) IC9.11(P:V-) IC9.12(D:+IN) R4.1 R315.1 R316.1 R904.1 VT6.1(E) VT7.1(E) VT8.3(B) VT9.3(B) X1.5 ; also sheet 1,2,3,4,5,8,9
MISO: DD1-.16(DA1) ; also sheet 3
N$13: R312.1 R313.1 R314.2
N$38: D3.A D4.A R101*11.1
N$39: C6.2 D1.A D3.C
N$40: C7.2 D2.A D4.C
N$41: R101*13.2 VT7.3(B)
N$42: R101*11.2 VT5.3(B)
N$43: C6.1 R1HUHUH.1
N$44: C7.1 R2K,.1
N$45: C8.2 D5.A D7.C
N$46: R4.2 VT5.2(C)
N$47: C9.2 D6.A D8.C
N$48: C8.1 R5.1
N$49: C9.1 R6.1
N$50: R8.1 VT7.2(C)
N$53: D5.C D6.C R101*13.1
N$54: C10.1 R10.1
N$55: C11.1 R11.1
N$56: C10.2 D14.C R101*14.1
N$57: R101*12.2 R101*14.2 VT6.3(B)
N$58: DD1-.9(RA5) X1.9
N$59: R12.1 VT6.2(C)
N$60: C11.2 D15.C R101*12.1
N$65: DD1-.8(DY3) X1.4
N$66: DD1-.7(RA4) X1.8
N$73: R310.1 R311.2
N$74: DD1-.6(DY2) X1.3
N$75: DD1-.5(DY1) X1.7
N$76: DD1-.4(RA3) X1.2
N$77: DD1-.3(RA2) X1.6
N$78: DD1-.2(RA1) X1.1
N$103: R311.1 R312.2 R313.2
N$110: R310.2 VMETER_IN.1
N$111: IC9.6(B:-IN) R906.2 VT9.2(C)
N$117: R3L0.2 VT11.2(C)
N$118: R4L0.1 VT11.3(B)
N$119: R4L0.2 U$14.2(C)
N$120: R1L0.2 VT11.1(E)
N$121: R2L0.1 U$14.3(A)
N$122: R1L0.1 R2L0.2 R3L0.1 U$14.1(R)
N$145: IC9.2(A:-IN) R901.2 VT8.2(C)
N$146: IC9.1(A:OUT) R902.1 VT8.1(E)
N$148: IC9.7(B:OUT) R907.1 VT9.1(E)
N$149: IC9.9(C:-IN) R902.2 R903.1 R907.2
N$150: IC9.10(C:+IN) R904.2
N$151: D13.A IC9.8(C:OUT) R903.2
N$152: D13.C IC9.13(D:-IN) R905.1
N$153: IC9.14(D:OUT) OUT1.1 R905.2
N$154: IN1.1 R901.1
N$155: IN2.1 R906.1
RESET: DD1-.12(RY5) ; also sheet 3
RX: DD1-.15(DA2)
SCK: DD1-.14(RY4) ; also sheet 3
TX: DD1-.17(RY3)
VMETR: C302.1 R314.1 R315.2 R316.2 ; also sheet 3
Unconnected: DD1-.13(DA3) DD1-.19(RY1)

### Notes on the sheet
- https://wm-help.net/lib/b/book/1865579333/57
- mosi вход
- →rx
- miso выход | → | ←
- ←tx | ← | ←
- → | →
- sck вход | → | →
- reset вход
- Vт+ = Vref * (1+ R1/R3)
  Vт- = Vref * (1+ ((R1*R2)/(R1+R2)) * (1/R3) )
- R[]*=ADC954/51.1Vin
- 4v
  R1=2k2+560/2=2.480k
  R2=3k
  vref  4.6375v  (=4.474)
  aref 4.00v (=3.995)

## Sheet 7 of 9
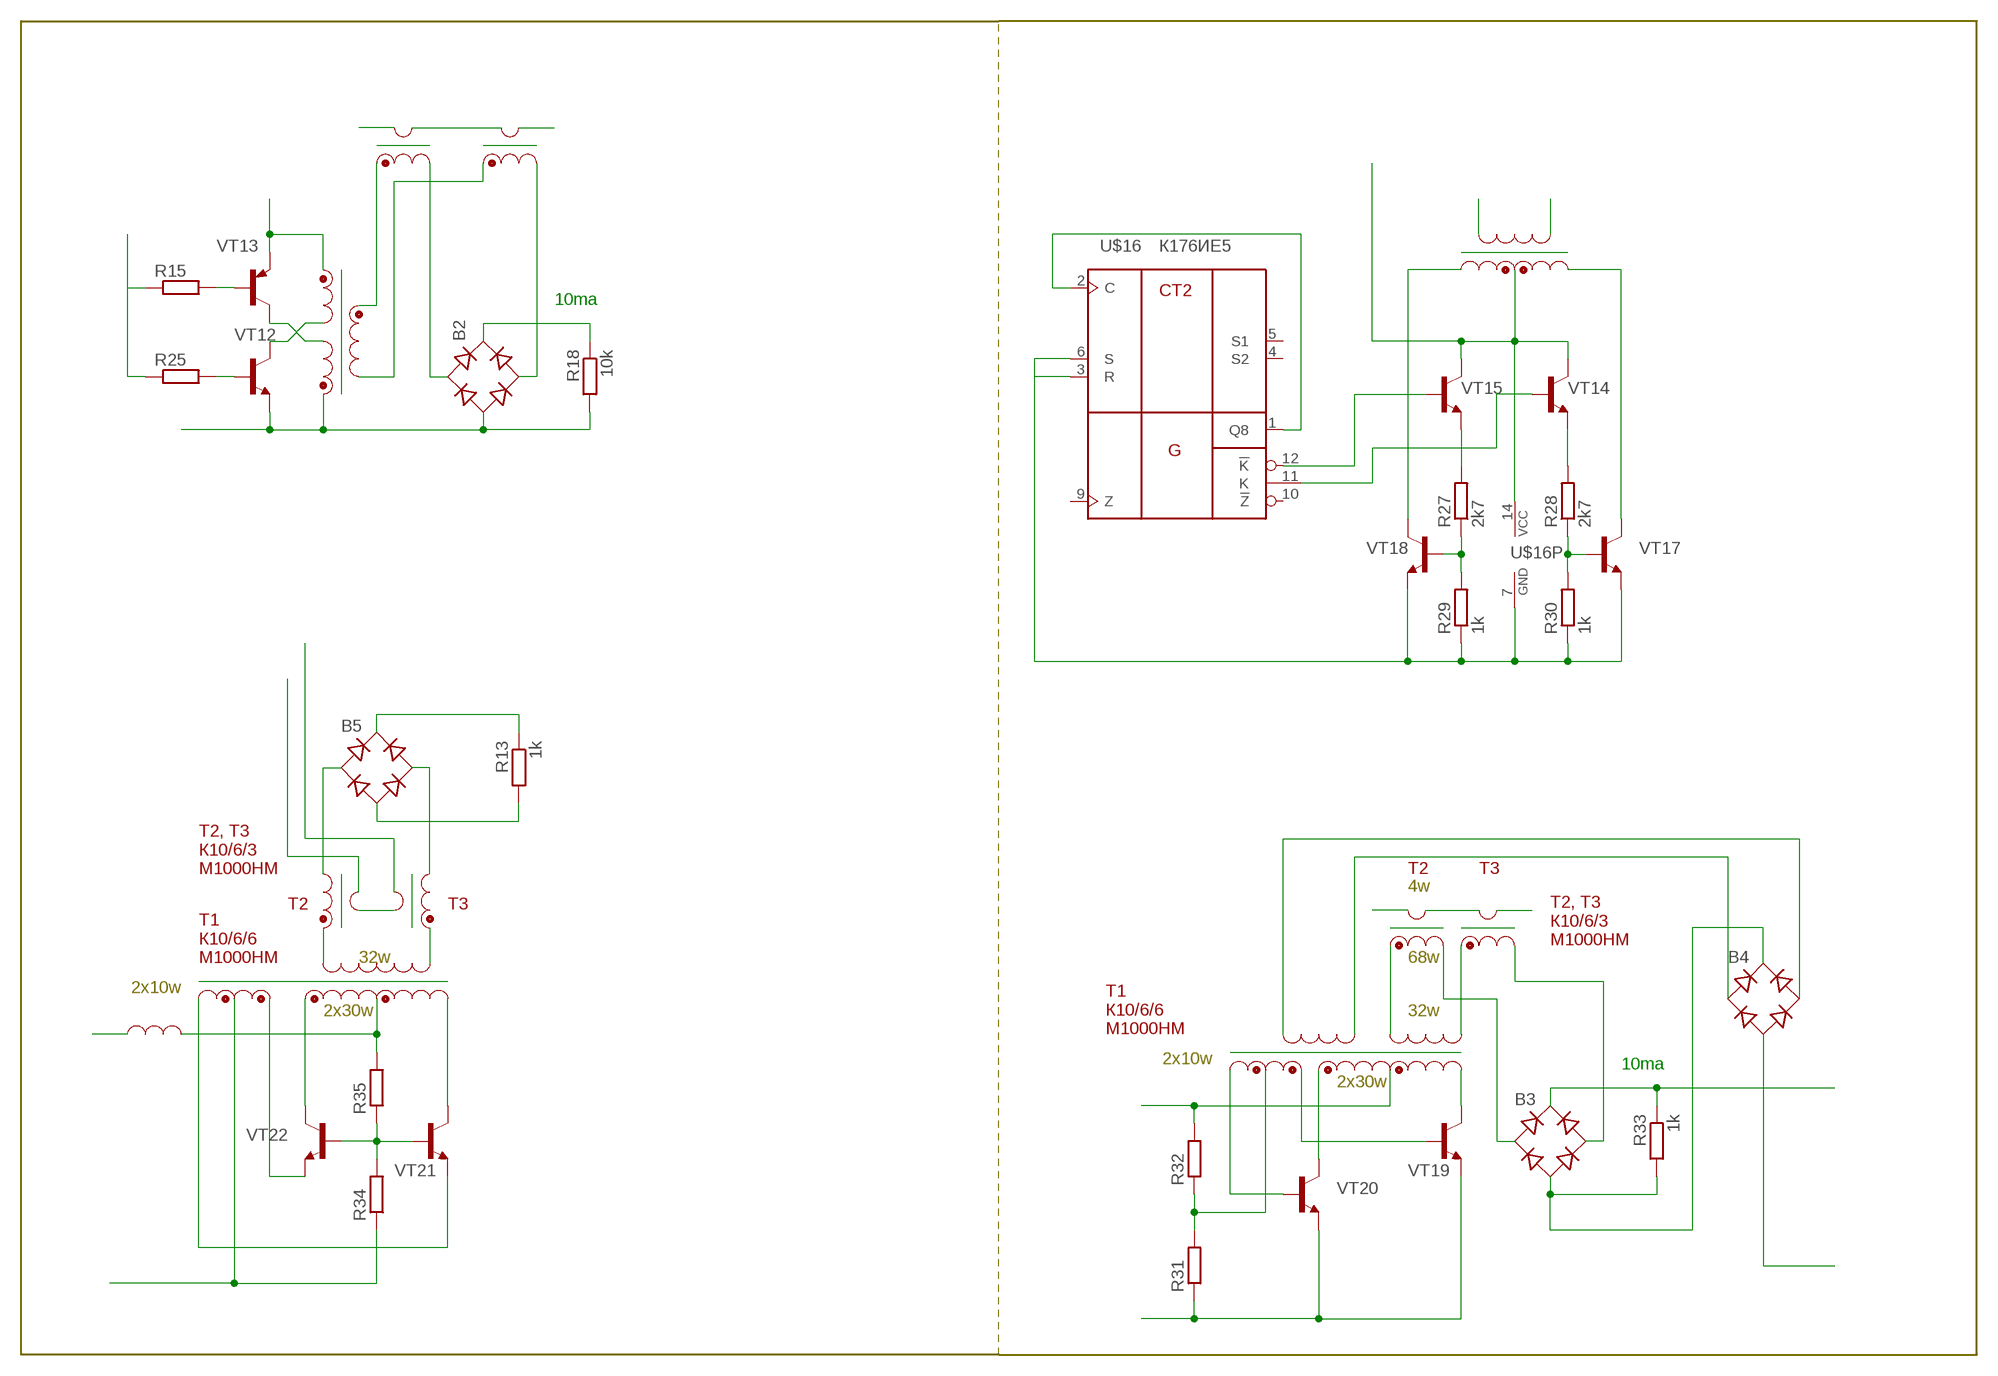
[diagram p9: schematic, sheet 7]

### Parts
B2  DBDB105G  [DB]
B3  DBDB105G  [DB]
B4  DBDB105G  [DB]
B5  DBDB105G  [DB]
R13  1k  R-EU_0411/12  [0411/12]
R15  R-EU_0411/12  [0411/12]
R18  10k  R-EU_0411/12  [0411/12]
R25  R-EU_0411/12  [0411/12]
R27  2k7  R-EU_R0805  [R0805]
R28  2k7  R-EU_R0805  [R0805]
R29  1k  R-EU_R0805  [R0805]
R30  1k  R-EU_R0805  [R0805]
R31  R-EU_0411/12  [0411/12]
R32  R-EU_0411/12  [0411/12]
R33  1k  R-EU_0411/12  [0411/12]
R34  R-EU_0411/12  [0411/12]
R35  R-EU_0411/12  [0411/12]
U$16  К176ИЕ5  [DIL14]
VT12  BJT_NPN_TO-92_CBE  [TO92]
VT13  BJT_PNP_SOT23_BCE  [SOT23]
VT14  BJT_NPN_TO-92_ECB  [TO92]
VT15  BJT_NPN_TO-92_ECB  [TO92]
VT17  BJT_NPN_TO-92_ECB  [TO92]
VT18  BJT_NPN_TO-92_ECB  [TO92]
VT19  BJT_NPN_TO-92_CBE  [TO92]
VT20  BJT_NPN_TO-92_CBE  [TO92]
VT21  BJT_NPN_TO-92_CBE  [TO92]
VT22  BJT_NPN_TO-92_CBE  [TO92]

### Nets
N$28: B5.- R13.2
N$29: B5.+ R13.1
N$30: VT19.1(C)
N$167: R15.2 VT13.1(B)
N$172: VT13.2(E)
N$182: B2.- R18.2 VT12.3(E)
N$186: B2.AC1
N$191: B2.AC2
N$193: B2.+ R18.1
N$198: VT12.1(C)
N$199: VT13.3(C)
N$211: R25.2 VT12.2(B)
N$212: R15.1 R25.1
N$215: U$16.1(Q8) U$16.2(C)
N$217: U$16.12(!K) VT15.3(B)
N$218: U$16.11(K) VT14.3(B)
N$219: U$16.14(VCC) VT14.2(C) VT15.2(C)
N$220: R28.1 R30.2 VT17.3(B)
N$221: R28.2 VT14.1(E)
N$222: R27.2 VT15.1(E)
N$224: R27.1 R29.2 VT18.3(B)
N$225: R29.1 R30.1 U$16.3(R) U$16.6(S) U$16.7(GND) VT17.1(E) VT18.1(E)
N$226: VT20.1(C)
N$227: R31.1 VT19.3(E) VT20.3(E)
N$229: VT18.2(C)
N$230: VT17.2(C)
N$234: B3.- B4.+ R33.2
N$235: R32.2
N$236: VT19.2(B)
N$237: VT20.2(B)
N$238: R31.2 R32.1
N$239: B3.AC1
N$243: B3.AC2
N$244: B4.AC1
N$248: B3.+ R33.1
N$249: B4.AC2
N$250: VT22.3(E)
N$251: B4.-
N$253: R35.2
N$254: VT21.1(C)
N$255: VT22.1(C)
N$257: VT21.3(E)
N$258: R34.1
N$259: R34.2 R35.1 VT21.2(B) VT22.2(B)
N$264: B5.AC2
N$268: B5.AC1
Unconnected: U$16.4(S2) U$16.5(S1) U$16.9(Z) U$16.10(!Z)

### Notes on the sheet
- 10ma
- T2, Т3
  К10/6/3
  М1000НМ
- T2 | T3
- 4w
- T2 | T3
- T2, Т3
  К10/6/3
  М1000НМ
- T1
  К10/6/6
  М1000НМ
- 32w | 68w
- 2x10w
- 2x30w | 32w
- T1
  К10/6/6
  М1000НМ
- 2x10w
- 10ma
- 2x30w

## Sheet 8 of 9: f2v
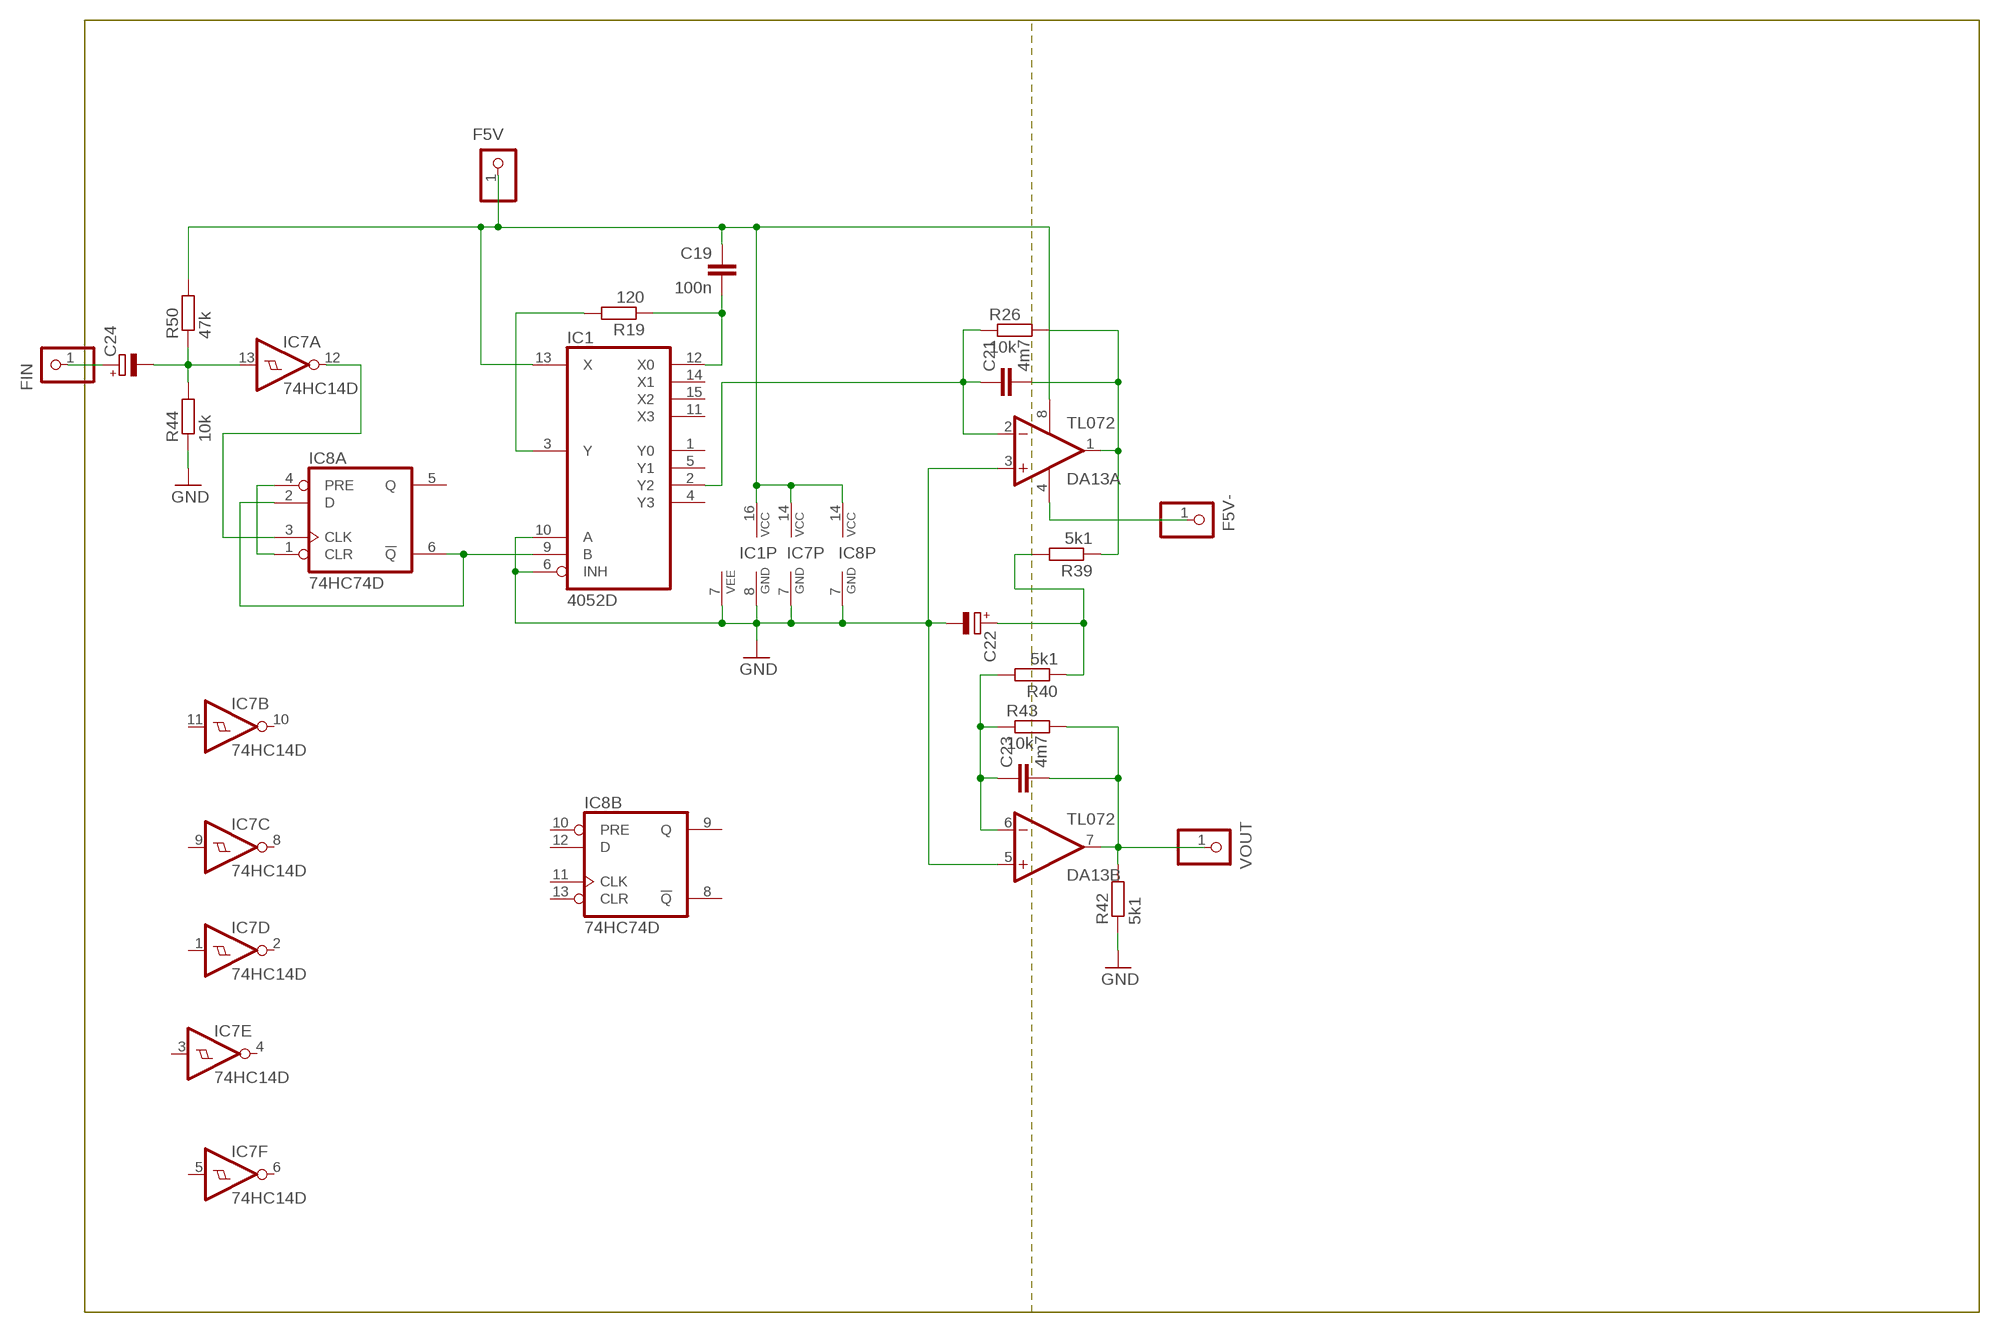
[diagram p10: schematic, sheet 8]

### Parts
C19  100n  C-EUC0805  [C0805]
C21  4m7  C-EUC1206  [C1206]
C22  CPOL-EUE2.5-6  [E2,5-6]
C23  4m7  C-EUC1206  [C1206]
C24  CPOL-EUE2.5-6  [E2,5-6]
DA13  TL072  LM358D  [SO08]
F5V  PINHD-1X1  [1X01]
F5V-  PINHD-1X1  [1X01]
FIN  PINHD-1X1  [1X01]
IC1  4052D  [SO16]
IC7  74HC14D  [SO14]
IC8  74HC74D  [SO14]
R19  120  R-EU_R0805  [R0805]
R26  10k  R-EU_R0805  [R0805]
R39  5k1  R-EU_R0805  [R0805]
R40  5k1  R-EU_R0805  [R0805]
R42  5k1  R-EU_R0805  [R0805]
R43  10k  R-EU_R0805  [R0805]
R44  10k  R-EU_R0805  [R0805]
R50  47k  R-EU_R0805  [R0805]
VOUT  PINHD-1X1  [1X01]

### Nets
GND: C22.- DA13.3(A:+IN) DA13.5(B:+IN) IC1.6(INH) IC1.7(VEE) IC1.8(GND) IC1.10(A) IC7.7(P:GND) IC8.7(P:GND) R42.1 R44.1 ; also sheet 1,2,3,4,5,6,9
N$339: IC1.3(Y) R19.2
N$340: C21.1 DA13.2(A:-IN) IC1.2(Y2) R26.1
N$343: C19.2 IC1.12(X0) R19.1
N$344: C19.1 DA13.8(P:V+) F5V.1 IC1.13(X) IC1.16(VCC) IC7.14(P:VCC) IC8.14(P:VCC) R50.2
N$392: C24.+ FIN.1
N$393: IC7.12(A:O) IC8.3(A:CLK)
N$394: C21.2 DA13.1(A:OUT) R26.2 R39.1
N$395: IC8.1(A:CLR) IC8.4(A:PRE)
N$396: C22.+ R39.2 R40.1
N$397: C23.1 DA13.6(B:-IN) R40.2 R43.1
N$398: C23.2 DA13.7(B:OUT) R42.2 R43.2 VOUT.1
N$399: IC1.9(B) IC8.2(A:D) IC8.6(A:!Q)
N$400: DA13.4(P:V-) F5V-.1
N$402: C24.- IC7.13(A:I) R44.2 R50.1
Unconnected: IC1.1(Y0) IC1.4(Y3) IC1.5(Y1) IC1.11(X3) IC1.14(X1) IC1.15(X2) IC7.1(D:I) IC7.2(D:O) IC7.3(E:I) IC7.4(E:O) IC7.5(F:I) IC7.6(F:O) IC7.8(C:O) IC7.9(C:I) IC7.10(B:O) IC7.11(B:I) IC8.5(A:Q) IC8.8(B:!Q) IC8.9(B:Q) IC8.10(B:PRE) IC8.11(B:CLK) IC8.12(B:D) IC8.13(B:CLR)

## Sheet 9 of 9
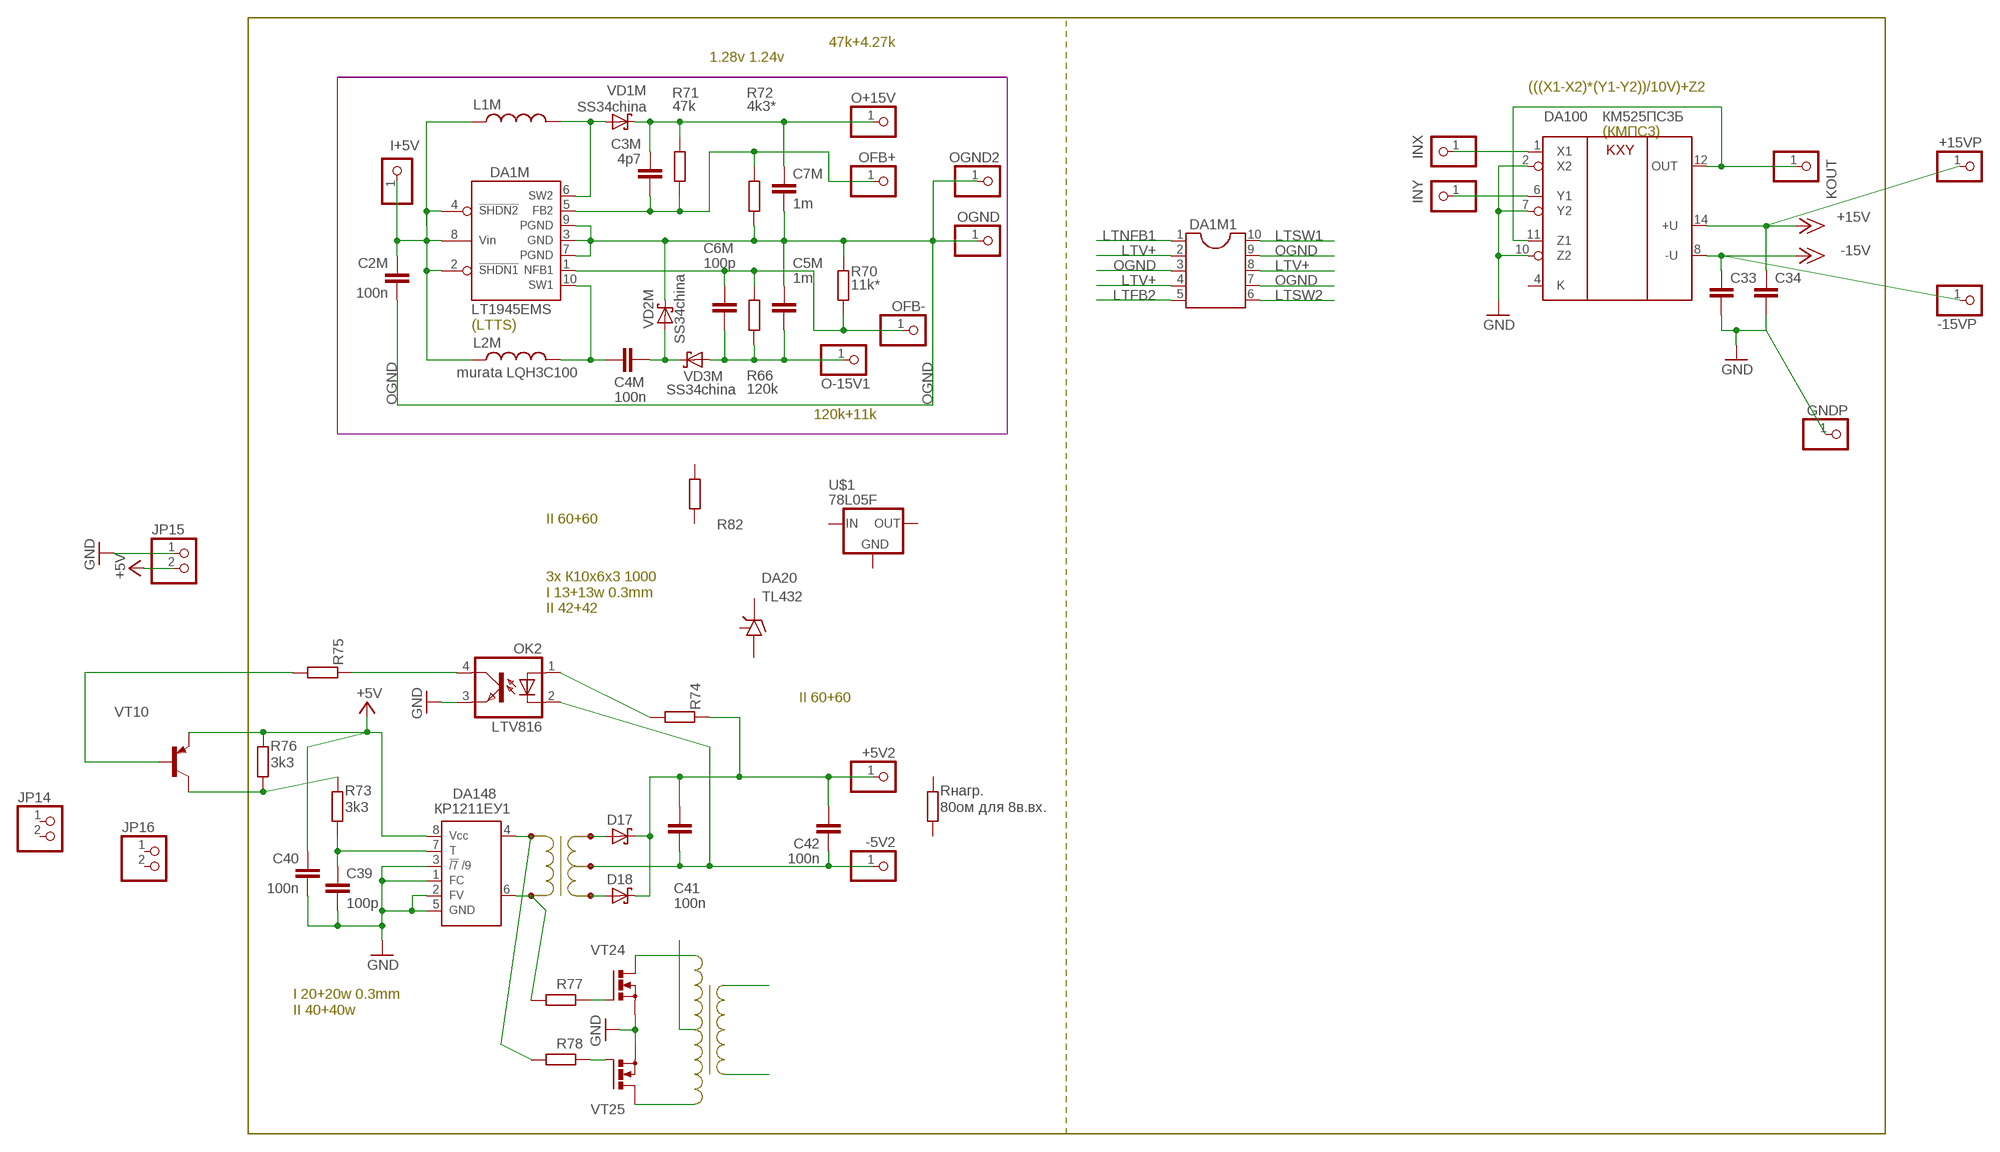
[diagram p11: schematic, sheet 9]

### Parts
+5V2  PINHD-1X1  [1X01]
+15VP  PINHD-1X1  [1X01]
-5V2  PINHD-1X1  [1X01]
-15VP  PINHD-1X1  [1X01]
C2M  100n  C-EUC0805  [C0805]
C3M  4p7  C-EUC0805  [C0805]
C4M  100n  C-EUC0805  [C0805]
C5M  1m  C-EUC0805  [C0805]
C6M  100p  C-EUC0805  [C0805]
C7M  1m  C-EUC0805  [C0805]
C33  C-EUC0805  [C0805]
C34  C-EUC0805  [C0805]
C39  100p  C-EUC0805  [C0805]
C40  100n  C-EUC0805  [C0805]
C41  100n  C-EUC0805  [C0805]
C42  100n  C-EUC0805  [C0805]
D17  SCHOTTKY-DIODESMD  [SMB]
D18  SCHOTTKY-DIODESMD  [SMB]
DA1M  LT1945EMS  LT1945  [MSOP10]
DA1M1  DIL10  [DIL10]
DA20  TL432  [SOT-23]
DA100  КМ525ПС3Б  525ПС3A  [DIL14]
DA148  КP1211ЕУ1  КР1211ЕУ1  [DIL8]
GNDP  PINHD-1X1  [1X01]
I+5V  PINHD-1X1  [1X01]
INX  PINHD-1X1  [1X01]
INY  PINHD-1X1  [1X01]
JP14  PINHD-1X2/90  [1X02/90]
JP15  PINHD-1X2/90  [1X02/90]
JP16  PINHD-1X2/90  [1X02/90]
KOUT  PINHD-1X1  [1X01]
L1M  L0207/7  [0207/7]
L2M  murata LQH3C100  L0207/7  [0207/7]
O+15V  PINHD-1X1  [1X01]
O-15V1  PINHD-1X1  [1X01]
OFB+  PINHD-1X1  [1X01]
OFB-  PINHD-1X1  [1X01]
OGND  PINHD-1X1  [1X01]
OGND2  PINHD-1X1  [1X01]
OK2  LTV816  [DIL04]
R66  120k  R-EU_R0805  [R0805]
R70  11k*  R-EU_R0805  [R0805]
R71  47k  R-EU_R0805  [R0805]
R72  4k3*  R-EU_R0805  [R0805]
R73  3k3  R-EU_R0805  [R0805]
R74  R-EU_R0805  [R0805]
R75  R-EU_R0805  [R0805]
R76  3k3  R-EU_R0805  [R0805]
R77  R-EU_0207/11  [0207/11]
R78  R-EU_R0805  [R0805]
R82  R-EU_0207/7  [0207/7]
Rнагр.  80ом для 8в.вх.  R-EU_R0805  [R0805]
U$1  78L05F  [SOT89]
U$30  T_PIN_NONAME  [PIN1X1N]
U$32  T_PIN_NONAME  [PIN1X1N]
U$33  T_PIN_NONAME  [PIN1X1N]
U$34  T_PIN_NONAME  [PIN1X1N]
U$35  T_PIN_NONAME  [PIN1X1N]
VD1M  SS34china  SCHOTTKY-DIODESMD  [SMB]
VD2M  SS34china  SCHOTTKY-DIODESMD  [SMB]
VD3M  SS34china  SCHOTTKY-DIODESMD  [SMB]
VT10  BJT_PNP_SOT23_BCE  [SOT23]
VT24  MOSFET-N_DPACK  [DPACK]
VT25  MOSFET-N_DPACK  [DPACK]

### Nets
+5V: C40.1 DA148.8(VCC) JP15.2 R76.1 VT10.2(E) ; also sheet 2,3,4,6
+15V: +15VP.1 C34.1 DA100.14(+U)
-15V: -15VP.1 C33.1 DA100.8(-U)
GND: C33.2 C34.2 C39.2 C40.2 DA100.2(X2) DA100.7(Y2) DA100.10(Z2) DA148.1(FC) DA148.2(FV) DA148.3(IN) DA148.5(GND) GNDP.1 JP15.1 OK2.3(EMIT) VT24.S VT25.S ; also sheet 1,2,3,4,5,6,8
LTFB2: C3M.2 DA1M1.5 DA1M.5(FB2) OFB+.1 R71.2 R72.2
LTNFB1: C6M.1 DA1M1.1 DA1M.1(NFB1) OFB-.1 R66.1 R70.2
LTSW1: C4M.2 DA1M1.10 DA1M.10(SW1) L2M.2
LTSW2: DA1M1.6 DA1M.6(SW2) L1M.2 VD1M.A
LTV+: C2M.1 DA1M1.2 DA1M1.4 DA1M1.8 DA1M.2(!SHDN1) DA1M.4(!SHDN2) DA1M.8(VIN) I+5V.1 L1M.1 L2M.1
N$299: DA100.1(X1) INX.1
N$302: DA100.6(Y1) INY.1
N$311: DA100.11(Z1) DA100.12(OUT) KOUT.1
N$357: C3M.1 C7M.1 O+15V.1 R71.1 VD1M.C
N$363: OK2.1(A) R74.2
N$364: C5M.2 C6M.2 O-15V1.1 R66.2 VD3M.A
N$365: C4M.1 VD2M.A VD3M.C
N$368: C39.1 DA148.7(T) R73.2
N$371: DA148.6(OUT1) R77.2 U$32.1(TNN1)
N$374: -5V2.1 C41.2 C42.2 OK2.2(C) U$33.1(TNN1)
N$375: DA148.4(OUT2) R78.2 U$30.1(TNN1)
N$376: +5V2.1 C41.1 C42.1 D17.C D18.C R74.1
N$377: OK2.4(COL) R75.1
N$378: D17.A U$34.1(TNN1)
N$379: D18.A U$35.1(TNN1)
N$380: VT25.D
N$381: R73.1 R76.2 VT10.3(C)
N$382: R75.2 VT10.1(B)
N$383: VT24.D
N$385: R78.1 VT25.G
N$386: R77.1 VT24.G
OGND: C2M.2 C5M.1 C7M.2 DA1M1.3 DA1M1.7 DA1M1.9 DA1M.3(GND) DA1M.7(PGND) DA1M.9(PGND) OGND2.1 OGND.1 R70.1 R72.1 VD2M.C
Unconnected: DA20.1(R) DA20.2(C) DA20.3(A) DA100.4(K) JP14.1 JP14.2 JP16.1 JP16.2 R82.1 R82.2 Rнагр..1 Rнагр..2 U$1.1(OUT) U$1.2(GND) U$1.2@1(GND) U$1.3(IN)

### Notes on the sheet
- 47k+4.27k
- 1.28v 1.24v
- (((X1-X2)*(Y1-Y2))/10V)+Z2
- (КМПС3)
- (LTTS)
- 120k+11k
- II 60+60
- 3х К10х6х3 1000
  I 13+13w 0.3mm
  II 42+42
- II 60+60
- I 20+20w 0.3mm
  II 40+40w

## Power pins joined to a net without a drawn wire
+: BT1.PWR@1(+)
V+: DA3.8(P:V+) DA5.8(P:V+)
V-: DA3.4(P:V-) DA5.4(P:V-)